# Altium project smart generator controller.PrjPcb (part 1 of 2)
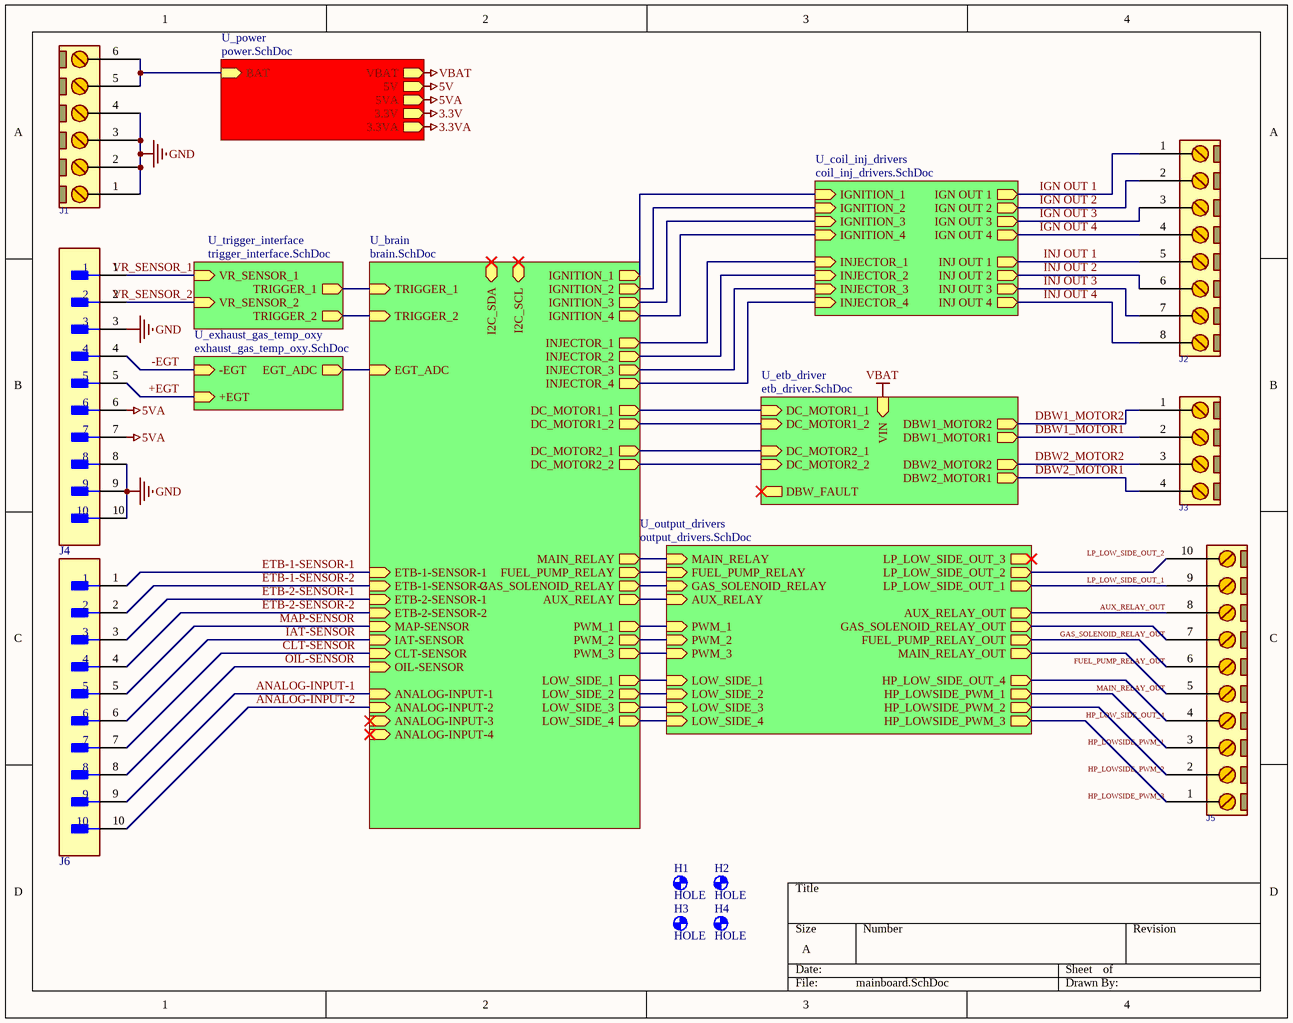
[diagram p0: mainboard.SchDoc]
8 sheets, 297 parts. Net scope: hierarchical (ports join the sheet entries above them; power ports are global).
Board file: PCB1.PcbDoc
Sheets:
  mainboard.SchDoc
    U_etb_driver = etb_driver.SchDoc
    U_power = power.SchDoc
    U_coil_inj_drivers = coil_inj_drivers.SchDoc
    U_brain = brain.SchDoc
    U_trigger_interface = trigger_interface.SchDoc
    U_output_drivers = output_drivers.SchDoc
    U_exhaust_gas_temp_oxy = exhaust_gas_temp_oxy.SchDoc

## Sheet mainboard.SchDoc
size A; SheetNumber: 1; SheetTotal: 8

### Parts
H1  HOLE  [P3.2]  (no BOM)
H2  HOLE  [P3.2]  (no BOM)
H3  HOLE  [P3.2]  (no BOM)
H4  HOLE  [P3.2]  (no BOM)
J1  CONN_TB6  [MSTB_6]  (value not drawn)
J2  CONN_TB8  [MSTB_8]  (value not drawn)
J3  CONN_TB4  [MSTB_4]  (value not drawn)
J4  PHOENIX MINI 10P  [CON_PHOENIX_MINI_10]  (value not drawn)
J5  CONN_TB10  [MSTB_10]  (value not drawn)
J6  PHOENIX MINI 10P  [CON_PHOENIX_MINI_10]  (value not drawn)

### Sub-sheets
U_brain = brain.SchDoc: LOW_SIDE_1 (out), INJECTOR_3 (out), INJECTOR_2 (out), INJECTOR_1 (out), I2C_SCL (bidir), I2C_SDA (bidir), TRIGGER_1 (in), MAIN_RELAY (out), FUEL_PUMP_RELAY (out), AUX_RELAY (out), DC_MOTOR1_2 (out), DC_MOTOR1_1 (out), IGNITION_1 (out), ETB-1-SENSOR-1 (in), ETB-1-SENSOR-2 (in), ETB-2-SENSOR-1 (in), ETB-2-SENSOR-2 (in), INJECTOR_4 (out), IGNITION_2 (out), IGNITION_3 (out), IGNITION_4 (out), DC_MOTOR2_2 (out), DC_MOTOR2_1 (out), LOW_SIDE_2 (out), LOW_SIDE_3 (out), LOW_SIDE_4 (out), TRIGGER_2 (in), MAP-SENSOR (in), IAT-SENSOR (in), CLT-SENSOR (in), OIL-SENSOR (in), ANALOG-INPUT-1 (in), ANALOG-INPUT-3 (in), ANALOG-INPUT-4 (in), ANALOG-INPUT-2 (in), PWM_1 (out), PWM_2 (out), PWM_3 (out), EGT_ADC (in), GAS_SOLENOID_RELAY (out)
U_coil_inj_drivers = coil_inj_drivers.SchDoc: IGN OUT 1 (out), IGN OUT 2 (out), IGN OUT 3 (out), IGN OUT 4 (out), INJ OUT 4 (out), INJ OUT 3 (out), INJ OUT 2 (out), INJ OUT 1 (out), IGNITION_2 (in), IGNITION_3 (in), IGNITION_4 (in), INJECTOR_1 (in), INJECTOR_2 (in), INJECTOR_3 (in), INJECTOR_4 (in), IGNITION_1 (in)
U_etb_driver = etb_driver.SchDoc: VIN (in), DBW1_MOTOR1 (out), DBW1_MOTOR2 (out), DBW2_MOTOR1 (out), DBW2_MOTOR2 (out), DBW_FAULT (out), DC_MOTOR1_1 (in), DC_MOTOR1_2 (in), DC_MOTOR2_1 (in), DC_MOTOR2_2 (in)
U_exhaust_gas_temp_oxy = exhaust_gas_temp_oxy.SchDoc: -EGT (in), +EGT (in), EGT_ADC (out)
U_output_drivers = output_drivers.SchDoc: MAIN_RELAY_OUT (out), FUEL_PUMP_RELAY_OUT (out), GAS_SOLENOID_RELAY_OUT (out), AUX_RELAY (in), PWM_1 (in), PWM_2 (in), PWM_3 (in), LOW_SIDE_1 (in), LOW_SIDE_2 (in), LOW_SIDE_3 (in), LOW_SIDE_4 (in), HP_LOWSIDE_PWM_1 (out), HP_LOWSIDE_PWM_2 (out), HP_LOWSIDE_PWM_3 (out), AUX_RELAY_OUT (out), HP_LOW_SIDE_OUT_4 (out), LP_LOW_SIDE_OUT_1 (out), LP_LOW_SIDE_OUT_2 (out), LP_LOW_SIDE_OUT_3 (out), MAIN_RELAY (in), FUEL_PUMP_RELAY (in), GAS_SOLENOID_RELAY (in)
U_power = power.SchDoc: BAT (in), VBAT (out), 5V (out), 5VA (out), 3.3V (out), 3.3VA (out)
U_trigger_interface = trigger_interface.SchDoc: VR_SENSOR_1 (in), VR_SENSOR_2 (in), TRIGGER_2 (out), TRIGGER_1 (out)

### Nets
5VA: J4.6 J4.7 ; sheet U_power/5VA
GND: J1.1 J1.2 J1.3 J1.4 J4.3 J4.8 J4.9 J4.10
VBAT: sheet U_etb_driver/VIN, sheet U_power/VBAT
+EGT: J4.5 ; sheet U_exhaust_gas_temp_oxy/+EGT
-EGT: J4.4 ; sheet U_exhaust_gas_temp_oxy/-EGT
ANALOG-INPUT-1: J6.9 ; sheet U_brain/ANALOG-INPUT-1
ANALOG-INPUT-2: J6.10 ; sheet U_brain/ANALOG-INPUT-2
AUX_RELAY_OUT: J5.8 ; sheet U_output_drivers/AUX_RELAY_OUT
CLT-SENSOR: J6.7 ; sheet U_brain/CLT-SENSOR
DBW1_MOTOR1: J3.2 ; sheet U_etb_driver/DBW1_MOTOR1
DBW1_MOTOR2: J3.1 ; sheet U_etb_driver/DBW1_MOTOR2
DBW2_MOTOR1: J3.4 ; sheet U_etb_driver/DBW2_MOTOR1
DBW2_MOTOR2: J3.3 ; sheet U_etb_driver/DBW2_MOTOR2
ETB-1-SENSOR-1: J6.1 ; sheet U_brain/ETB-1-SENSOR-1
ETB-1-SENSOR-2: J6.2 ; sheet U_brain/ETB-1-SENSOR-2
ETB-2-SENSOR-1: J6.3 ; sheet U_brain/ETB-2-SENSOR-1
ETB-2-SENSOR-2: J6.4 ; sheet U_brain/ETB-2-SENSOR-2
FUEL_PUMP_RELAY_OUT: J5.6 ; sheet U_output_drivers/FUEL_PUMP_RELAY_OUT
GAS_SOLENOID_RELAY_OUT: J5.7 ; sheet U_output_drivers/GAS_SOLENOID_RELAY_OUT
HP_LOW_SIDE_OUT_4: J5.4 ; sheet U_output_drivers/HP_LOW_SIDE_OUT_4
HP_LOWSIDE_PWM_1: J5.3 ; sheet U_output_drivers/HP_LOWSIDE_PWM_1
HP_LOWSIDE_PWM_2: J5.2 ; sheet U_output_drivers/HP_LOWSIDE_PWM_2
HP_LOWSIDE_PWM_3: J5.1 ; sheet U_output_drivers/HP_LOWSIDE_PWM_3
IAT-SENSOR: J6.6 ; sheet U_brain/IAT-SENSOR
IGN OUT 1: J2.1 ; sheet U_coil_inj_drivers/IGN OUT 1
IGN OUT 2: J2.2 ; sheet U_coil_inj_drivers/IGN OUT 2
IGN OUT 3: J2.3 ; sheet U_coil_inj_drivers/IGN OUT 3
IGN OUT 4: J2.4 ; sheet U_coil_inj_drivers/IGN OUT 4
INJ OUT 1: J2.5 ; sheet U_coil_inj_drivers/INJ OUT 1
INJ OUT 2: J2.6 ; sheet U_coil_inj_drivers/INJ OUT 2
INJ OUT 3: J2.7 ; sheet U_coil_inj_drivers/INJ OUT 3
INJ OUT 4: J2.8 ; sheet U_coil_inj_drivers/INJ OUT 4
LP_LOW_SIDE_OUT_1: J5.9 ; sheet U_output_drivers/LP_LOW_SIDE_OUT_1
LP_LOW_SIDE_OUT_2: J5.10 ; sheet U_output_drivers/LP_LOW_SIDE_OUT_2
MAIN_RELAY_OUT: J5.5 ; sheet U_output_drivers/MAIN_RELAY_OUT
MAP-SENSOR: J6.5 ; sheet U_brain/MAP-SENSOR
OIL-SENSOR: J6.8 ; sheet U_brain/OIL-SENSOR
VR_SENSOR_1: J4.1 ; sheet U_trigger_interface/VR_SENSOR_1
VR_SENSOR_2: J4.2 ; sheet U_trigger_interface/VR_SENSOR_2
NetF2_1: J1.5 J1.6 ; sheet U_power/BAT
NetQ15_1: sheet U_brain/MAIN_RELAY, sheet U_output_drivers/MAIN_RELAY
NetQ15_2: sheet U_brain/FUEL_PUMP_RELAY, sheet U_output_drivers/FUEL_PUMP_RELAY
NetQ15_3: sheet U_brain/GAS_SOLENOID_RELAY, sheet U_output_drivers/GAS_SOLENOID_RELAY
NetQ15_4: sheet U_brain/AUX_RELAY, sheet U_output_drivers/AUX_RELAY
NetQ15_5: sheet U_brain/LOW_SIDE_1, sheet U_output_drivers/LOW_SIDE_1
NetQ15_6: sheet U_brain/LOW_SIDE_2, sheet U_output_drivers/LOW_SIDE_2
NetQ15_7: sheet U_brain/LOW_SIDE_3, sheet U_output_drivers/LOW_SIDE_3
NetR5_2: sheet U_coil_inj_drivers/IGNITION_2, sheet U_brain/IGNITION_2
NetR6_2: sheet U_coil_inj_drivers/IGNITION_1, sheet U_brain/IGNITION_1
NetR7_2: sheet U_coil_inj_drivers/INJECTOR_2, sheet U_brain/INJECTOR_2
NetR8_2: sheet U_coil_inj_drivers/INJECTOR_1, sheet U_brain/INJECTOR_1
NetR13_2: sheet U_coil_inj_drivers/IGNITION_4, sheet U_brain/IGNITION_4
NetR14_2: sheet U_coil_inj_drivers/IGNITION_3, sheet U_brain/IGNITION_3
NetR15_2: sheet U_coil_inj_drivers/INJECTOR_4, sheet U_brain/INJECTOR_4
NetR16_2: sheet U_coil_inj_drivers/INJECTOR_3, sheet U_brain/INJECTOR_3
NetR99_2: sheet U_brain/TRIGGER_1, sheet U_trigger_interface/TRIGGER_1
NetR115_2: sheet U_brain/TRIGGER_2, sheet U_trigger_interface/TRIGGER_2
NetR136_2: sheet U_brain/PWM_2, sheet U_output_drivers/PWM_2
NetR137_2: sheet U_brain/PWM_3, sheet U_output_drivers/PWM_3
NetR141_2: sheet U_brain/LOW_SIDE_4, sheet U_output_drivers/LOW_SIDE_4
NetR142_2: sheet U_brain/PWM_1, sheet U_output_drivers/PWM_1
NetU8_3: sheet U_etb_driver/DC_MOTOR1_1, sheet U_brain/DC_MOTOR1_1
NetU8_19: sheet U_etb_driver/DC_MOTOR1_2, sheet U_brain/DC_MOTOR1_2
NetU9_3: sheet U_etb_driver/DC_MOTOR2_1, sheet U_brain/DC_MOTOR2_1
NetU9_19: sheet U_etb_driver/DC_MOTOR2_2, sheet U_brain/DC_MOTOR2_2
NetU11_8: sheet U_brain/EGT_ADC, sheet U_exhaust_gas_temp_oxy/EGT_ADC

### Library data of the parts
H1-H4 = MOUNT-HOLE: MOUNTING HOLE with drill center marker
J1 = CONN_MSTB_6: CONN, PHOENIX MSTB, 5-G, 5.08mm pitch; PARAM2: 320V; PARAM: 12A; VALUE: CONN_TB6
J2 = CONN_MSTB_8: CONN, PHOENIX MSTB, 5-G, 5.08mm pitch; PARAM2: 320V; PARAM: 12A; VALUE: CONN_TB8
J3 = CONN_MSTB_4: CONN, PHOENIX MSTB, 5-G, 5.08mm pitch; PARAM2: 320V; PARAM: 12A; VALUE: CONN_TB4
J4 J6 = PHOENIX MINI 10P: 1803358 Header; 8 A; 160 V; 3.81; 10; Soldering; 1.2 mm; 2.5 kV; 160/250 V; PBT; NexarPartId: 71670; Number of Positions Per Level: 10; Voltage Rating: 160V; Current: 8A; Number of Levels: 1; Connector Type: Plug; Approvals: CSA, UL; Voltage Rating (DC): 640mV; Gender: Male; Voltage: 300V; Test Voltage: 2.5kV; Pitch: 3.81mm; Housing Material: Polybutylene; Depth: 9.2mm; Max Current Rating: 8A; Voltage Rating (AC): 160V; Contact Material: Tin; Termination: Solder; Lead Pitch: 3.81mm; Current Rating: 8A; Mount: Through Hole; Flammability Rating: UL94 V-0; Number of Rows: 1; Lead Free: Lead Free; RoHS: Compliant; Length: 39.49mm; Weight: 113.398093g; Housing Color: Green; Number of Contacts: 10; Contact Gender: Male; Number of Positions: 10; Height: 7.4mm; Orientation: Right Angle; Color: Green; Contact Plating: Tin; Number of Poles: 10; Width: 39.49mm
J5 = CONN_MSTB_10: CONN, PHOENIX MSTB, 5-G, 5.08mm pitch; PARAM2: 320V; PARAM: 12A; VALUE: CONN_TB10

## Sheet etb_driver.SchDoc
size A4; SheetNumber: 4; SheetTotal: 8
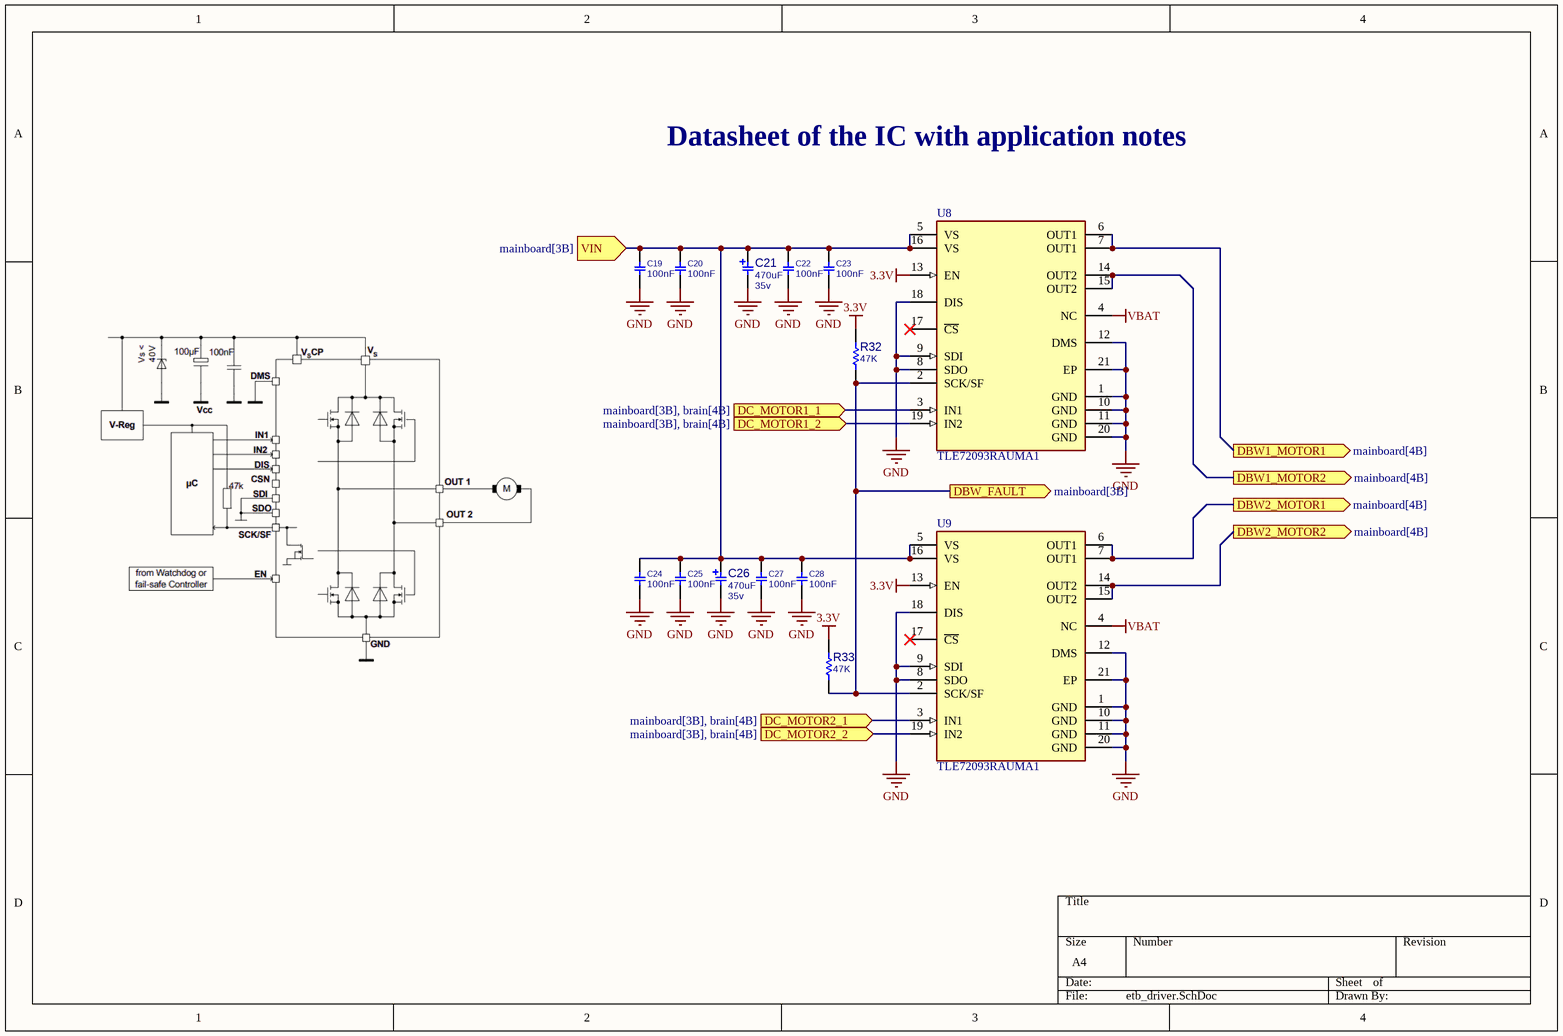
[diagram p1: etb_driver.SchDoc]

### Parts
C19  100nF  [C1206]
C20  100nF  [C1206]
C21  PARAM2: 35v  [C_EL_D10L10]  (hidden comment: 470uF)
C22  100nF  [C1206]
C23  100nF  [C1206]
C24  100nF  [C1206]
C25  100nF  [C1206]
C26  PARAM2: 35v  [C_EL_D10L10]  (hidden comment: 470uF)
C27  100nF  [C1206]
C28  100nF  [C1206]
R32  47K  [R0805]
R33  47K  [R0805]  (no BOM)
U8  TLE72093RAUMA1  [FP-PG-DSO-20-MFG]
U9  TLE72093RAUMA1  [FP-PG-DSO-20-MFG]

### Ports
DBW1_MOTOR1 (out, see mainboard[4B]), DBW1_MOTOR2 (out, see mainboard[4B]), DBW2_MOTOR1 (out, see mainboard[4B]), DBW2_MOTOR2 (out, see mainboard[4B]), DBW_FAULT (out, see mainboard[3B]), DC_MOTOR1_1 (in, see mainboard[3B], brain[4B]), DC_MOTOR1_2 (in, see mainboard[3B], brain[4B]), DC_MOTOR2_1 (in, see mainboard[3B], brain[4B]), DC_MOTOR2_2 (in, see mainboard[3B], brain[4B]), VIN (in, see mainboard[3B])

### Nets
3.3V: R32.2 R33.2 U8.13(EN) U9.13(EN)
GND: C19.1 C20.1 C21.2 C22.1 C23.1 C24.1 C25.1 C26.2 C27.1 C28.1 U8.1(GND) U8.8(SDO) U8.9(SDI) U8.10(GND) U8.11(GND) U8.12(DMS) U8.18(DIS) U8.20(GND) U8.21(EP) U9.1(GND) U9.8(SDO) U9.9(SDI) U9.10(GND) U9.11(GND) U9.12(DMS) U9.18(DIS) U9.20(GND) U9.21(EP)
VBAT: C19.2 C20.2 C21.1 C22.2 C23.2 C24.2 C25.2 C26.1 C27.2 C28.2 U8.4(NC) U8.5(VS) U8.16(VS) U9.4(NC) U9.5(VS) U9.16(VS) ; port VIN
DBW1_MOTOR1: U8.6(OUT1) U8.7(OUT1) ; port DBW1_MOTOR1
DBW1_MOTOR2: U8.14(OUT2) U8.15(OUT2) ; port DBW1_MOTOR2
DBW2_MOTOR1: U9.6(OUT1) U9.7(OUT1) ; port DBW2_MOTOR1
DBW2_MOTOR2: U9.14(OUT2) U9.15(OUT2) ; port DBW2_MOTOR2
NetR32_1: R32.1 R33.1 U8.2(SCK/SF) U9.2(SCK/SF) ; port DBW_FAULT
NetU8_3: U8.3(IN1) ; port DC_MOTOR1_1
NetU8_19: U8.19(IN2) ; port DC_MOTOR1_2
NetU9_3: U9.3(IN1) ; port DC_MOTOR2_1
NetU9_19: U9.19(IN2) ; port DC_MOTOR2_2

Not connected (* = marked no-connect by the designer): U8 17(~{CS})*; U9 17(~{CS})*

### Notes on the sheet
- Datasheet of the IC with application notes <https://www.infineon.com/dgdl/Infineon-TLE7209_2R-DS-v01_05-en.pdf?fileId=db3a30431f848401011fc76ca8e77a06>

### Library data of the parts
C19 C20 C22-C25 C27 C28 = CAP_SMD_MLCC_1206: CAP, MLCC; PARAM: -, -%; MANF_P#: MANF_PART#; PARAM2: -V; PRICE: 100= 1$; MANF: -; ASSEMBLY: ASSEMBLY; VALUE: 100nF
C21 C26 = CAP_SMD_EL_470uF_35v: CAP, SMD, ELEC,; MANF_P#: MANF_PART#; DESC: DESCRIPTION; DIST#: MOUSER; PARAM: 20%; PRICE: 10= -$; MANF: MANF; ASSEMBLY: ASSEMBLY; VALUE: 470uF
R32 R33 = RES_SMD_0805: RESISTOR, SMD; PARAM: -W; DESC: DESCRIPTION; DIST#: MOUSER; PARAM2: 1%; MANF_P#: -; MANF: -; ASSEMBLY: ASSEMBLY; PRICE: 100= 0.5$; VALUE: 47K
U8 U9 = TLE7209: IC MOTOR DRIVER 3.5V-5.5V 20DSO; Logic Function: AND GATE; Max Supply Voltage: 28V; Output Current: 5A; Interface: SPI; RoHS Compliant: Yes; Lead Free: Contains Lead; Series: -; Max Operating Temperature: 150°C; Packaging: Tape and Reel; Mount: Surface Mount; Halogen Free: Halogen Free; Min Operating Temperature: -40°C

## Sheet power.SchDoc
size A; SheetNumber: 3; SheetTotal: 8
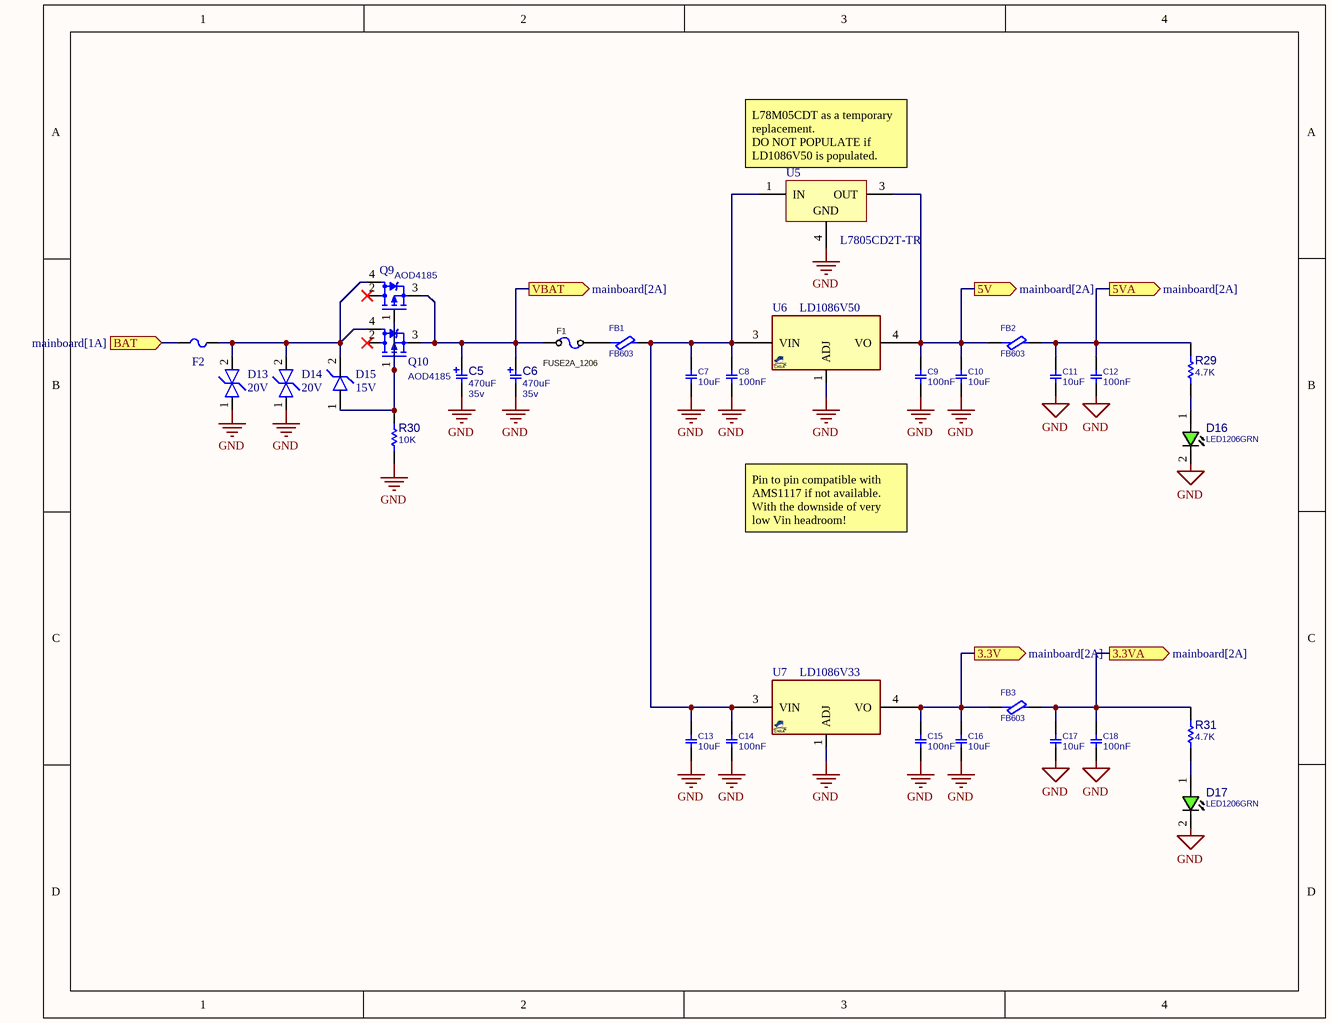
[diagram p2: power.SchDoc]

### Parts
C5  PARAM2: 35v  [C_EL_D10L10]  (hidden comment: 470uF)
C6  PARAM2: 35v  [C_EL_D10L10]  (hidden comment: 470uF)
C7  10uF  [C1206]
C8  100nF  [C1206]
C9  100nF  [C1206]
C10  10uF  [C1206]
C11  10uF  [C1206]
C12  100nF  [C1206]
C13  10uF  [C1206]
C14  100nF  [C1206]
C15  100nF  [C1206]
C16  10uF  [C1206]
C17  10uF  [C1206]
C18  100nF  [C1206]
D13  20V  [FP-SMBJ-CA-MFG]
D14  20V  [FP-SMBJ-CA-MFG]
D15  15V  [D_SOD80]
D16  LED1206GRN  [LED1206GRN]
D17  LED1206GRN  [LED1206GRN]
F1  FUSE2A_1206  [F1206]
F2  F=15 A  [FUSE - Double PAD]  (value not drawn)
FB1  FB603  [L1206]
FB2  FB603  [L1206]
FB3  FB603  [L1206]
Q9  AOD4185  [D2PAK_3]
Q10  AOD4185  [D2PAK_3]
R29  4.7K  [R0805]
R30  10K  [R0805]
R31  4.7K  [R0805]
U5  L7805CD2T-TR  [TO-263_M]
U6  LD1086V50  [DPAK_3]
U7  LD1086V33  [DPAK_3]

### Ports
3.3V (out, see mainboard[2A]), 3.3VA (out, see mainboard[2A]), 5V (out, see mainboard[2A]), 5VA (out, see mainboard[2A]), BAT (in, see mainboard[1A]), VBAT (out, see mainboard[2A])

### Nets
3.3V: C15.2 C16.2 FB3.2 U7.4(VO) ; port 3.3V
3.3VA: C17.2 C18.2 FB3.1 R31.2 ; port 3.3VA
5V: C9.2 C10.2 FB2.2 U5.3(OUT) U6.4(VO) ; port 5V
5VA: C11.2 C12.2 FB2.1 R29.2 ; port 5VA
GND: C5.2 C6.2 C7.1 C8.1 C9.1 C10.1 C11.1 C12.1 C13.1 C14.1 C15.1 C16.1 C17.1 C18.1 D13.1 D14.1 D16.2(CATHODE) D17.2(CATHODE) R30.1 U5.4(GND) U6.1(ADJ) U7.1(ADJ)
VBAT: C5.1 C6.1 F1.1 Q9.3(S) Q10.3(S) ; port VBAT
NetC7_2: C7.2 C8.2 C13.2 C14.2 FB1.1 U5.1(IN) U6.3(VIN) U7.3(VIN)
NetD13_2: D13.2 D14.2 D15.2 F2.2 Q9.4(D) Q10.4(D)
NetD15_1: D15.1 Q9.1(G) Q10.1(G) R30.2
NetD16_1: D16.1(ANODE) R29.1
NetD17_1: D17.1(ANODE) R31.1
NetF1_2: F1.2 FB1.2
NetF2_1: F2.1 ; port BAT

Not connected (* = marked no-connect by the designer): Q9 2(D)*; Q10 2(D)*

### Notes on the sheet
- (near U5) L78M05CDT as a temporary replacement.
  DO NOT POPULATE if LD1086V50 is populated.
- Pin to pin compatible with AMS1117 if not available.
  With the downside of very low Vin headroom!

### Library data of the parts
C5 C6 = CAP_SMD_EL_470uF_35v: as C21 on sheet etb_driver; PRICE: 10= -$; MANF: MANF; ASSEMBLY: ASSEMBLY; VALUE: 470uF
C7 C10 C11 C13 C16 C17 = CAP_SMD_MLCC: CAP, MLCC; PARAM: C0G, 10%; DESC: CAP, MLCC, 1nF, 50V, C0G, 10%, 0402; MANF_P#: MANF_PART#; MANF: Murata; PARAM2: 50V; PRICE: 100= 1$; ASSEMBLY: ASSEMBLY; VALUE: 10uF
C8 C9 C12 C14 C15 C18 = CAP_SMD_MLCC_1206: as C19 on sheet etb_driver; PRICE: 100= 1$; MANF: -; ASSEMBLY: ASSEMBLY; VALUE: 100nF
D13 D14 = TVS: TVS DIODE; Direction: Bidirectional; Reverse Standoff Voltage: 20V; ComponentLink2Description: Datasheet; ComponentLink2URL: https://www.bourns.com/docs/Product-Datasheets/SMBJ.pdf
D15 = Zener-SOD-80
D16 D17 = LED_SMD_1206_GRN: LED, SMD, 1206, GREEN; PARAM: 20mA; DESC: DESCRIPTION; PARAM2: 2.2V; MANF: -; ASSEMBLY: ASSEMBLY; PRICE: 36t@Javan; MANF_P#: -; VALUE: LED1206GRN
F1 = FUSE_3A_1206_SLOW: Fuse, 3A, 32VDC, 1206, SMD, Slow Blow; PARAM: 3A; 32VDC; Slow Blow; MANF: Bourns; MANF_P#: SF-1206SP300-2; PARAM2: 0.027Ohm; PRICE: 0.9$; VALUE: FUSE2A_1206
F2 = Fuse 5x20 with holdeer pins: Fuses 5x20; Designer: Abbas Basereh; Desc.: fuse with holder pins 5x20; Data: 28-12-2016
FB1-FB3 = FBEAD_SMD: FERRITE_Bead, SMD; MANF: MURATA; PARAM: 120@100MHz; PARAM2: 1A; MANF_P#: BLM15AG121SN1D; VALUE: FB603
Q9 Q10 = MOSP_IRF4905_D2PAK: HEXFET Power MOSFET; ASSEMBLY: ASSEMBLY; MANF_P#: IRF4905; VALUE: AOD4185
R29-R31 = RES_SMD_0805: as R32 on sheet etb_driver; MANF_P#: -; MANF: -; ASSEMBLY: ASSEMBLY; PRICE: 100= 0.5$
  R29 R31: VALUE: 4.7K
  R30: VALUE: 10K
U5 = CMP-0244-00213-1: Positive Voltage Regulator, 3-Pin D2PAK, Tape and Reel; PackageReference: TO-263; ComponentLink2URL: http://www.st.com/internet/com/TECHNICAL_RESOURCES/TECHNICAL_LITERATURE/DATASHEET/CD00000444.pdf; PackageDescription: 3-Pin Transistor Outline Package 2.54 mm Pitch, 15.4 mm Lead Span (D2PAK); DatasheetVersion: 16/11/2011; ComponentLink2Description: Datasheet; ComponentLink1Description: Manufacturer URL; PackageVersion: 2011; ComponentLink1URL: http://www.st.com
U6 U7 = VREG_1086_TO252: REG, Linear, LDO1.3, Adj, 1A, TO-252; MANF_P#: LD1086DTTR, LD1086D2MTR; MANF: ST; PARAM2: 2.8~30VIN, 1.3VDROP, 1.25VREF; PARAM: 1A
  U6: VALUE: LD1086V50
  U7: VALUE: LD1086V33

## Sheet coil_inj_drivers.SchDoc
size A4; SheetNumber: 2; SheetTotal: 8
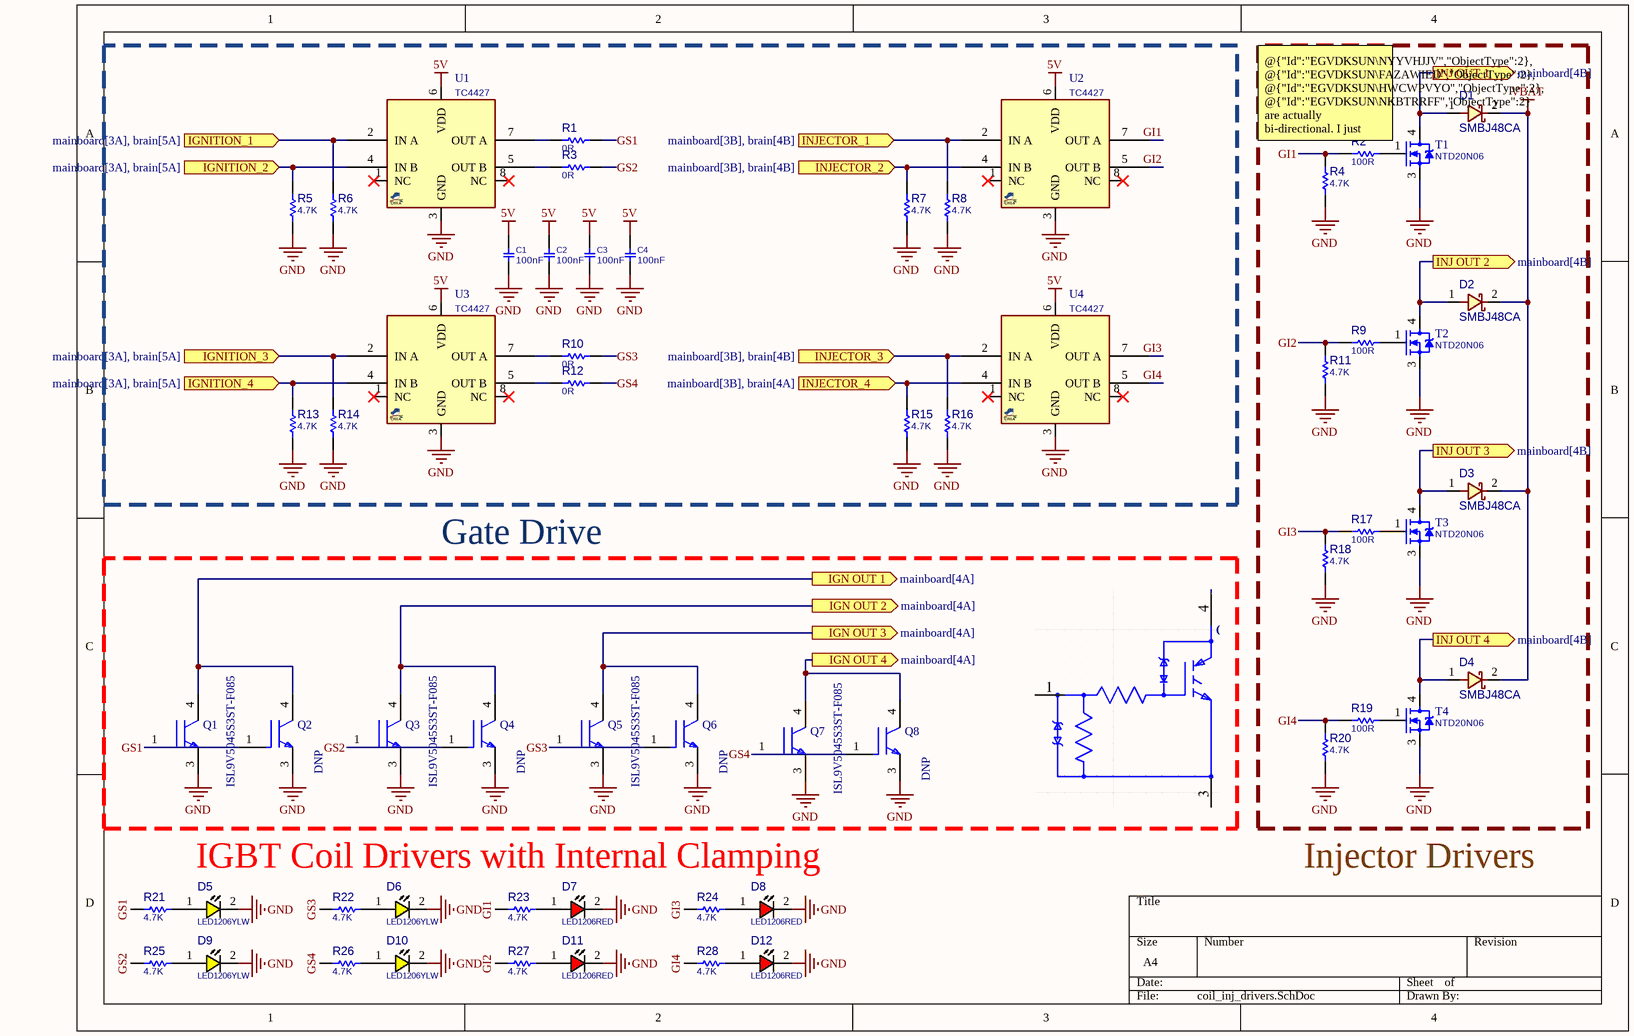
[diagram p3: coil_inj_drivers.SchDoc]

### Parts
C1  100nF  [C1206]
C2  100nF  [C1206]
C3  100nF  [C1206]
C4  100nF  [C1206]
D1  SMBJ48CA  [D_SMB]
D2  SMBJ48CA  [D_SMB]
D3  SMBJ48CA  [D_SMB]
D4  SMBJ48CA  [D_SMB]
D5  LED1206YLW  [LED1206YLW]
D6  LED1206YLW  [LED1206YLW]
D7  LED1206RED  [LED1206RED]
D8  LED1206RED  [LED1206RED]
D9  LED1206YLW  [LED1206YLW]
D10  LED1206YLW  [LED1206YLW]
D11  LED1206RED  [LED1206RED]
D12  LED1206RED  [LED1206RED]
Q1  ISL9V5045S3ST-F085  [FP-418AJ-MFG]
Q2  DNP  [FP-369AS-MFG]
Q3  ISL9V5045S3ST-F085  [FP-418AJ-MFG]
Q4  DNP  [FP-369AS-MFG]
Q5  ISL9V5045S3ST-F085  [FP-418AJ-MFG]
Q6  DNP  [FP-369AS-MFG]
Q7  ISL9V5045S3ST-F085  [FP-418AJ-MFG]
Q8  DNP  [FP-369AS-MFG]
R1  0R  [R0805]
R2  100R  [R0805]
R3  0R  [R0805]
R4  4.7K  [R0805]
R5  4.7K  [R0805]
R6  4.7K  [R0805]
R7  4.7K  [R0805]
R8  4.7K  [R0805]
R9  100R  [R0805]
R10  0R  [R0805]
R11  4.7K  [R0805]
R12  0R  [R0805]
R13  4.7K  [R0805]
R14  4.7K  [R0805]
R15  4.7K  [R0805]
R16  4.7K  [R0805]
R17  100R  [R0805]
R18  4.7K  [R0805]
R19  100R  [R0805]
R20  4.7K  [R0805]
R21  4.7K  [R0805]
R22  4.7K  [R0805]
R23  4.7K  [R0805]
R24  4.7K  [R0805]
R25  4.7K  [R0805]
R26  4.7K  [R0805]
R27  4.7K  [R0805]
R28  4.7K  [R0805]
T1  NTD20N06  [DPAK_3]
T2  NTD20N06  [DPAK_3]
T3  NTD20N06  [DPAK_3]
T4  NTD20N06  [DPAK_3]
U1  TC4427  [SO_8]
U2  TC4427  [SO_8]
U3  TC4427  [SO_8]
U4  TC4427  [SO_8]

### Ports
IGN OUT 1 (out, see mainboard[4A]), IGN OUT 2 (out, see mainboard[4A]), IGN OUT 3 (out, see mainboard[4A]), IGN OUT 4 (out, see mainboard[4A]), IGNITION_1 (in, see mainboard[3A], brain[5A]), IGNITION_2 (in, see mainboard[3A], brain[5A]), IGNITION_3 (in, see mainboard[3A], brain[5A]), IGNITION_4 (in, see mainboard[3A], brain[5A]), INJ OUT 1 (out, see mainboard[4B]), INJ OUT 2 (out, see mainboard[4B]), INJ OUT 3 (out, see mainboard[4B]), INJ OUT 4 (out, see mainboard[4B]), INJECTOR_1 (in, see mainboard[3B], brain[4B]), INJECTOR_2 (in, see mainboard[3B], brain[4B]), INJECTOR_3 (in, see mainboard[3B], brain[4B]), INJECTOR_4 (in, see mainboard[3B], brain[4A])

### Nets
5V: C1.2 C2.2 C3.2 C4.2 U1.6(VDD) U2.6(VDD) U3.6(VDD) U4.6(VDD)
GND: C1.1 C2.1 C3.1 C4.1 D5.2(CATHODE) D6.2(CATHODE) D7.2(CATHODE) D8.2(CATHODE) D9.2(CATHODE) D10.2(CATHODE) D11.2(CATHODE) D12.2(CATHODE) Q1.3(E) Q2.3(E) Q3.3(E) Q4.3(E) Q5.3(E) Q6.3(E) Q7.3(E) Q8.3(E) R4.1 R5.1 R6.1 R7.1 R8.1 R11.1 R13.1 R14.1 R15.1 R16.1 R18.1 R20.1 T1.3(S) T2.3(S) T3.3(S) T4.3(S) U1.3(GND) U2.3(GND) U3.3(GND) U4.3(GND)
VBAT: D1.2 D2.2 D3.2 D4.2
GI1: R2.2 R4.2 R23.2 U2.7(OUT_A)
GI2: R9.2 R11.2 R27.2 U2.5(OUT_B)
GI3: R17.2 R18.2 R24.2 U4.7(OUT_A)
GI4: R19.2 R20.2 R28.2 U4.5(OUT_B)
GS1: Q1.1(GATE) Q2.1(GATE) R1.1 R21.2
GS2: Q3.1(GATE) Q4.1(GATE) R3.1 R25.2
GS3: Q5.1(GATE) Q6.1(GATE) R10.1 R22.2
GS4: Q7.1(GATE) Q8.1(GATE) R12.1 R26.2
IGN OUT 1: Q1.4(C) Q2.4(C) ; port IGN OUT 1
IGN OUT 2: Q3.4(C) Q4.4(C) ; port IGN OUT 2
IGN OUT 3: Q5.4(C) Q6.4(C) ; port IGN OUT 3
IGN OUT 4: Q7.4(C) Q8.4(C) ; port IGN OUT 4
INJ OUT 1: D1.1 T1.4(D) ; port INJ OUT 1
INJ OUT 2: D2.1 T2.4(D) ; port INJ OUT 2
INJ OUT 3: D3.1 T3.4(D) ; port INJ OUT 3
INJ OUT 4: D4.1 T4.4(D) ; port INJ OUT 4
NetD5_1: D5.1(ANODE) R21.1
NetD6_1: D6.1(ANODE) R22.1
NetD7_1: D7.1(ANODE) R23.1
NetD8_1: D8.1(ANODE) R24.1
NetD9_1: D9.1(ANODE) R25.1
NetD10_1: D10.1(ANODE) R26.1
NetD11_1: D11.1(ANODE) R27.1
NetD12_1: D12.1(ANODE) R28.1
NetR1_2: R1.2 U1.7(OUT_A)
NetR2_1: R2.1 T1.1(G)
NetR3_2: R3.2 U1.5(OUT_B)
NetR5_2: R5.2 U1.4(IN_B) ; port IGNITION_2
NetR6_2: R6.2 U1.2(IN_A) ; port IGNITION_1
NetR7_2: R7.2 U2.4(IN_B) ; port INJECTOR_2
NetR8_2: R8.2 U2.2(IN_A) ; port INJECTOR_1
NetR9_1: R9.1 T2.1(G)
NetR10_2: R10.2 U3.7(OUT_A)
NetR12_2: R12.2 U3.5(OUT_B)
NetR13_2: R13.2 U3.4(IN_B) ; port IGNITION_4
NetR14_2: R14.2 U3.2(IN_A) ; port IGNITION_3
NetR15_2: R15.2 U4.4(IN_B) ; port INJECTOR_4
NetR16_2: R16.2 U4.2(IN_A) ; port INJECTOR_3
NetR17_1: R17.1 T3.1(G)
NetR19_1: R19.1 T4.1(G)

Not connected (* = marked no-connect by the designer): U1 1(NC)* 8(NC)*; U2 1(NC)* 8(NC)*; U3 1(NC)* 8(NC)*; U4 1(NC)* 8(NC)*

### Notes on the sheet
- @{"Id":"EGVDKSUN\NYYVHJJV","ObjectType":2}, @{"Id":"EGVDKSUN\FAZAWIED","ObjectType":2}, @{"Id":"EGVDKSUN\HWCWPVYO","ObjectType":2}, @{"Id":"EGVDKSUN\NKBTRRFF","ObjectType":2} are actually bi-directional. I just didn't have the symbol :(   The footprint is correct though :)
- Gate Drive
- IGBT Coil Drivers with Internal Clamping
- Injector Drivers

### Library data of the parts
C1-C4 = CAP_SMD_MLCC: as C7 on sheet power; PRICE: 100= 1$; ASSEMBLY: ASSEMBLY; VALUE: 100nF
D1-D4 = DIODE_SMD_SCHOTTKY_SS34: DIODE, SCHOTTKY, 20V, 3A; MANF: VISHAY; MANF_P#: SS34; DESC: DESCRIPTION; ASSEMBLY: ASSEMBLY; PRICE: PRICE; PARAM2: 3A; PARAM: 20V; VALUE: SMBJ48CA
D5 D6 D9 D10 = LED_SMD_1206_YLW: LED, SMD, 1206, YELLOW; DESC: DESCRIPTION; MANF_P#: MANF_PART#; PARAM2: 2.2V; MANF: MANF; ASSEMBLY: ASSEMBLY; PRICE: 36t@Javan; VALUE: LED1206YLW
D7 D8 D11 D12 = LED_SMD_1206_RED: LED, SMD, 1206, RED; DESC: DESCRIPTION; MANF_P#: MANF_PART#; PARAM2: 2.2V; MANF: MANF; ASSEMBLY: ASSEMBLY; PRICE: 36t@Javan; VALUE: LED1206RED
Q1 Q3 Q5 Q7 = CMP-00278-87655068-1: ISL9V5045S3ST-F085 Trans IGBT Chip N-CH 445V 51A 300000mW Automotive 3-Pin(2+Tab) D2PAK T/R; Element Configuration: Single; Clamping Voltage: 450V; Collector Emitter Breakdown Voltage: 480V; Collector Emitter Saturation Voltage: 1.25V; Turn-Off Delay Time: 10.8µs; Turn-On Delay Time: 700ns; Power Dissipation: 300W; Max Junction Temperature (Tj): 175°C; Collector Emitter Voltage (VCEO): 1.6V; RoHS: Compliant; Max Collector Current: 51A; Schedule B: 8541290080, 8541290080; Mount: Surface Mount; Max Operating Temperature: 175°C; Min Operating Temperature: -40°C; Number of Pins: 3; NexarPartId: 87655068; Max Breakdown Voltage: 480V; Lead Free: Lead Free; Max Power Dissipation: 300W; Continuous Collector Current: 51A; Height: 5.08mm; Case/Package: TO-263-3; Weight: 1.31247g
Q2 Q4 Q6 Q8 = IGNITION IGBT: NexarPartId: 87655026; Collector Emitter Saturation Voltage: 1.15V; Collector Emitter Voltage (VCEO): 1.5V; Max Collector Current: 41A; Element Configuration: Single; Max Breakdown Voltage: 400V; Max Power Dissipation: 150W; Radiation Hardening: No; RoHS: Compliant; Schedule B: 8541290080, 8541290080|8541290080, 8541290080|8541290080|8541290080, 8541290080|8541290080|8541290080|8541290080; Number of Pins: 3; Max Operating Temperature: 175°C; Mount: Surface Mount; Case/Package: DPAK; Min Operating Temperature: -55°C; Clamping Voltage: 400V; Weight: 260.37mg; Collector Emitter Breakdown Voltage: 400V
R1-R28 = RES_SMD_0805: as R32 on sheet etb_driver; MANF_P#: -; MANF: -; ASSEMBLY: ASSEMBLY; PRICE: 100= 0.5$
  R1 R3 R10 R12: VALUE: 0R
  R2 R9 R17 R19: VALUE: 100R
  R4-R8 R11 R13-R16 R18 R20-R28: VALUE: 4.7K
T1-T4 = MOSN_NTD20N06_DPAK: MOSFET, N-CH, 60V, 20A, 39mRDS, 1~2VGSth; MANF_P#: NTD20N06L; PARAM2: 60VDS, 1~2VGSth; PARAM: 20A, 39mRDS, Cin700pF, -55~150oC; MANF: ON; ASSEMBLY: ASSEMBLY; PRICE: 0.9$; VALUE: NTD20N06
U1-U4 = MOS_DUAL_TC4427: power Mosfet Driver, Dual, High-Speed, 1.5A; ASSEMBLY: ASSEMBLY; MANF_P#: TC4427; VALUE: TC4427

## Sheet brain.SchDoc
size A3; SheetNumber: 5; SheetTotal: 8
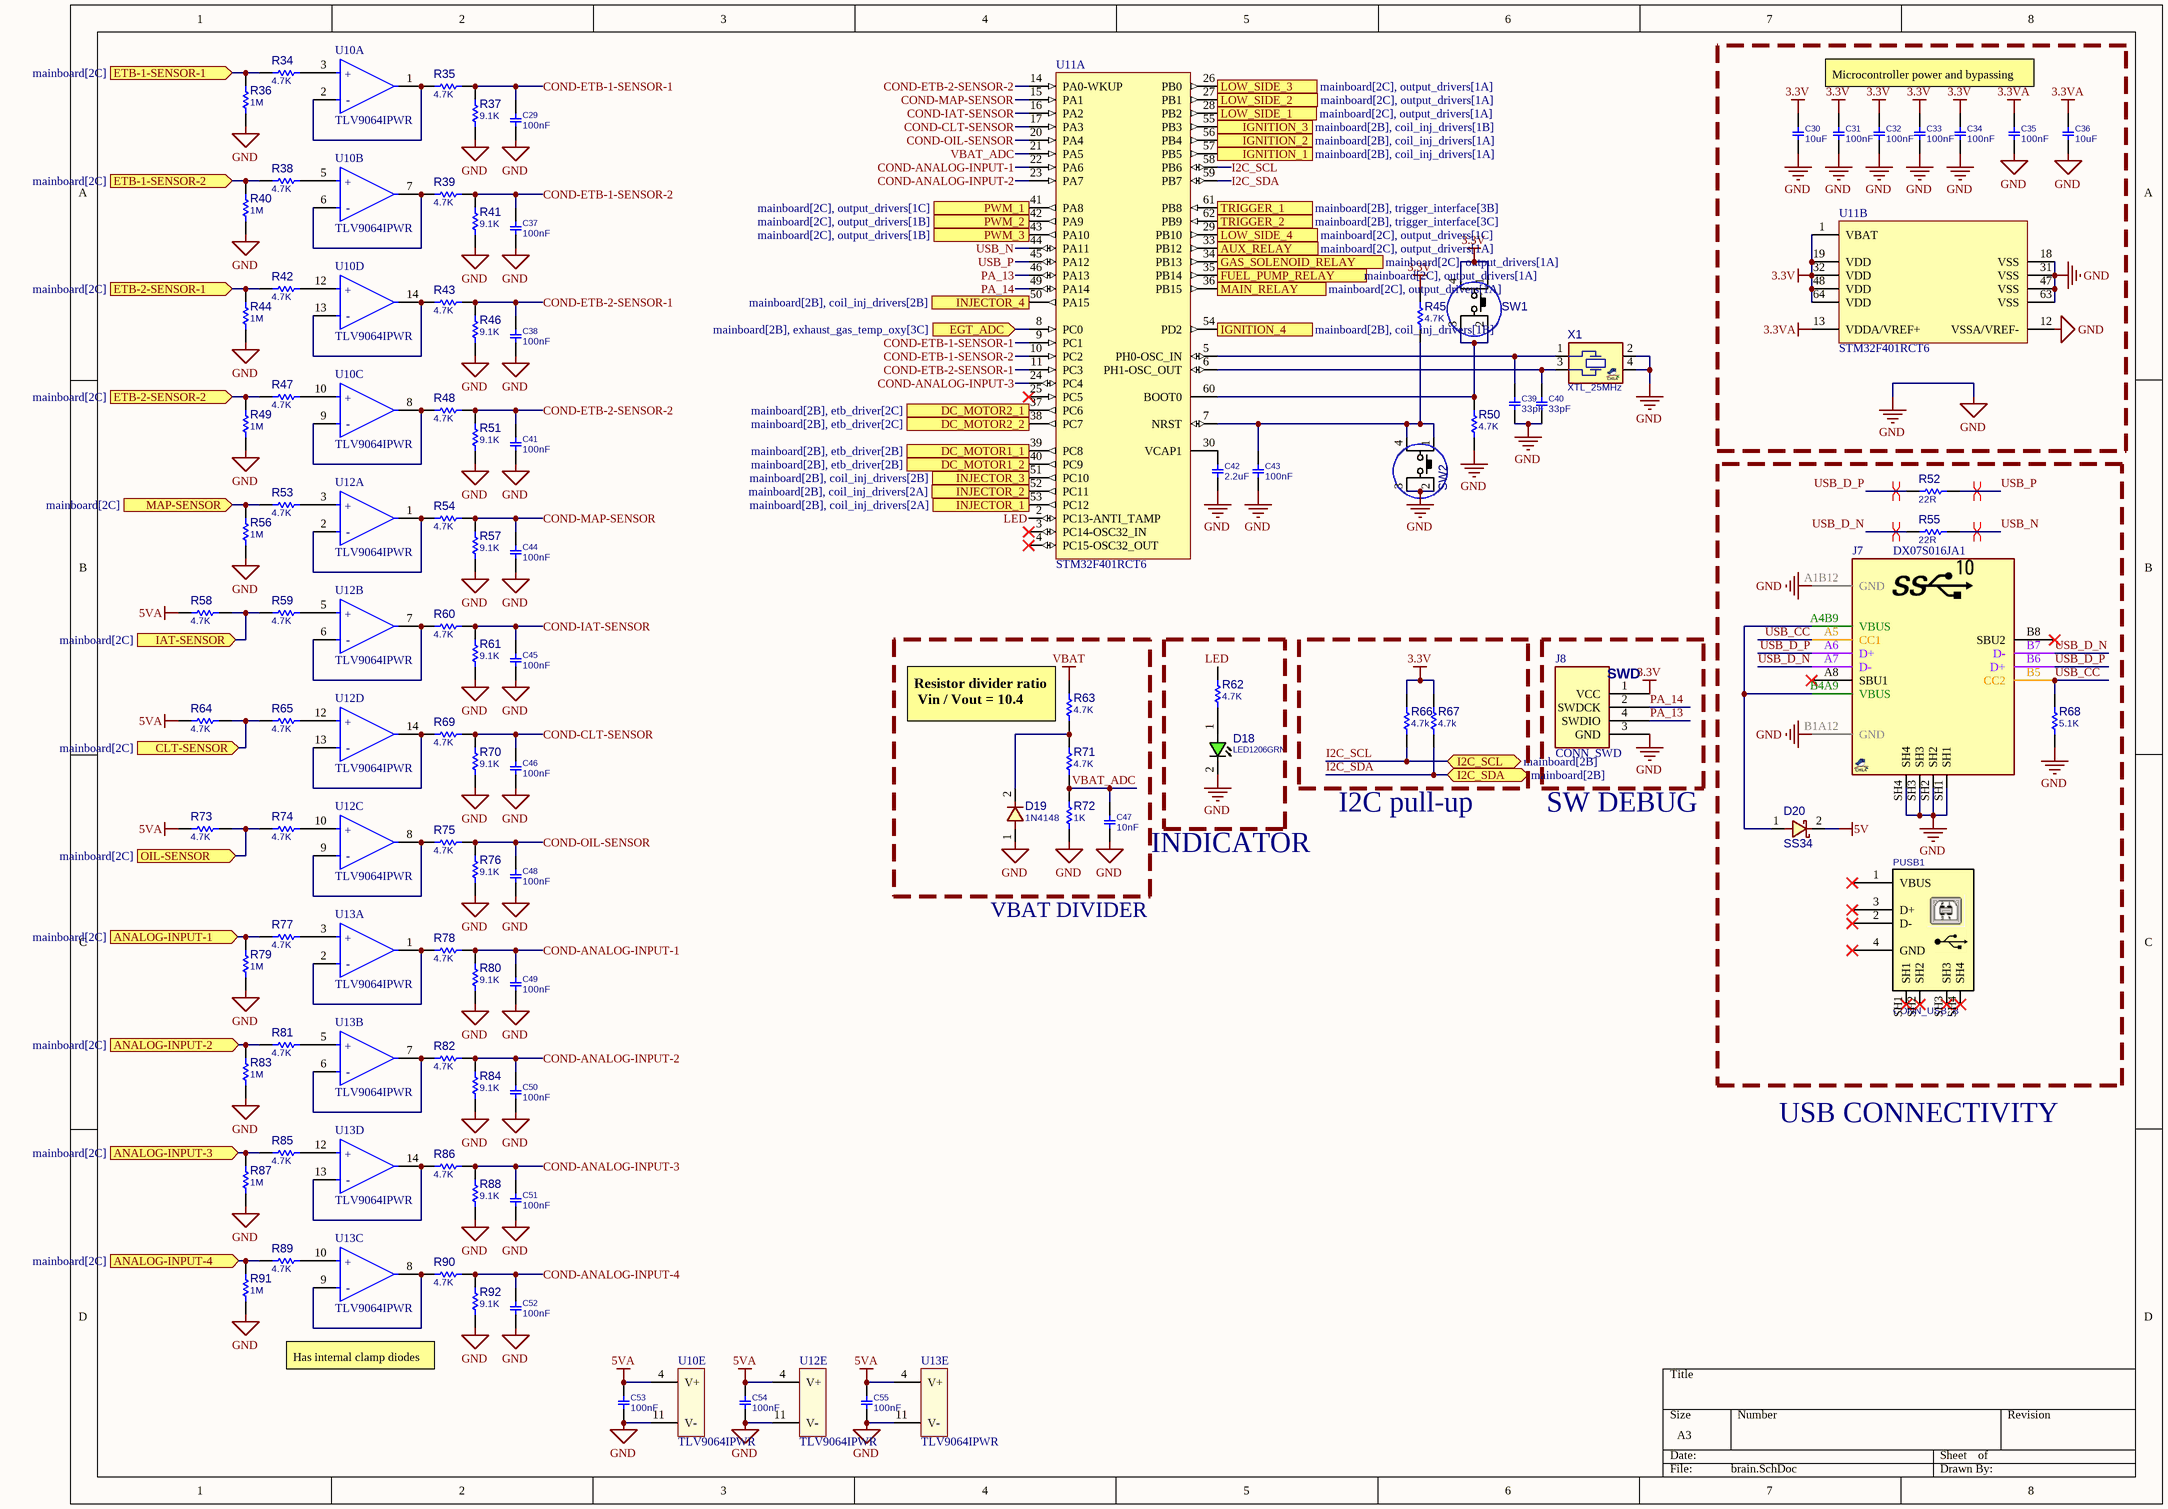
[diagram p4: brain.SchDoc]

### Parts
C29  100nF  [C0805]
C30  10uF  [C0805]
C31  100nF  [C0805]
C32  100nF  [C0805]
C33  100nF  [C0805]
C34  100nF  [C0805]
C35  100nF  [C0805]
C36  10uF  [C0805]
C37  100nF  [C0805]
C38  100nF  [C0805]
C39  33pF  [C0805]
C40  33pF  [C0805]
C41  100nF  [C0805]
C42  2.2uF  [C0805]
C43  100nF  [C0805]
C44  100nF  [C0805]
C45  100nF  [C0805]
C46  100nF  [C0805]
C47  10nF  [C0805]
C48  100nF  [C0805]
C49  100nF  [C0805]
C50  100nF  [C0805]
C51  100nF  [C0805]
C52  100nF  [C0805]
C53  100nF  [C0805]
C54  100nF  [C0805]
C55  100nF  [C0805]
D18  LED1206GRN  [LED1206GRN]
D19  1N4148  [D_SOD80]
D20  SS34  [D_SMB]
J7  DX07S016JA1  [USBC_SMD_16_DX07S016JA1]
J8  CONN_SWD  [WF_4]
PUSB1  CONN_USB_B  [USB_B_ST]
R34  4.7K  [R0805]
R35  4.7K  [R0805]
R36  1M  [R0805]
R37  9.1K  [R0805]
R38  4.7K  [R0805]
R39  4.7K  [R0805]
R40  1M  [R0805]
R41  9.1K  [R0805]
R42  4.7K  [R0805]
R43  4.7K  [R0805]
R44  1M  [R0805]
R45  4.7K  [R0805]
R46  9.1K  [R0805]
R47  4.7K  [R0805]
R48  4.7K  [R0805]
R49  1M  [R0805]
R50  4.7K  [R0805]
R51  9.1K  [R0805]
R52  22R  [R0805]
R53  4.7K  [R0805]
R54  4.7K  [R0805]
R55  22R  [R0805]
R56  1M  [R0805]
R57  9.1K  [R0805]
R58  4.7K  [R0805]
R59  4.7K  [R0805]
R60  4.7K  [R0805]
R61  9.1K  [R0805]
R62  4.7K  [R0805]
R63  4.7K  [R0805]
R64  4.7K  [R0805]
R65  4.7K  [R0805]
R66  4.7k  [R0805]
R67  4.7k  [R0805]
R68  5.1K  [R0805]
R69  4.7K  [R0805]
R70  9.1K  [R0805]
R71  4.7K  [R0805]
R72  1K  [R0805]
R73  4.7K  [R0805]
R74  4.7K  [R0805]
R75  4.7K  [R0805]
R76  9.1K  [R0805]
R77  4.7K  [R0805]
R78  4.7K  [R0805]
R79  1M  [R0805]
R80  9.1K  [R0805]
R81  4.7K  [R0805]
R82  4.7K  [R0805]
R83  1M  [R0805]
R84  9.1K  [R0805]
R85  4.7K  [R0805]
R86  4.7K  [R0805]
R87  1M  [R0805]
R88  9.1K  [R0805]
R89  4.7K  [R0805]
R90  4.7K  [R0805]
R91  1M  [R0805]
R92  9.1K  [R0805]
SW1  PUSHBUTTON  [SWPBS_SPDT_5X5X1]  (value not drawn)
SW2  PUSHBUTTON  [SWPBS_SPDT_5X5X1]  (value not drawn)
U10  TLV9064IPWR  [TTSOP-14]  (parts A,B,C,D,E of 5)
U11  STM32F401RCT6  [STM-LQFP64_L]  (parts A,B of 2)
U12  TLV9064IPWR  [TTSOP-14]  (parts A,B,C,D,E of 5)
U13  TLV9064IPWR  [TTSOP-14]  (parts A,B,C,D,E of 5)
X1  XTL_25MHz  [XTL_4_3225]

### Blocks framed on the sheet
VBAT DIVIDER: C47 D19 R63 R71 R72

### Ports
ANALOG-INPUT-1 (in, see mainboard[2C]), ANALOG-INPUT-2 (in, see mainboard[2C]), ANALOG-INPUT-3 (in, see mainboard[2C]), ANALOG-INPUT-4 (in, see mainboard[2C]), AUX_RELAY (out, see mainboard[2C], output_drivers[1A]), CLT-SENSOR (in, see mainboard[2C]), DC_MOTOR1_1 (out, see mainboard[2B], etb_driver[2B]), DC_MOTOR1_2 (out, see mainboard[2B], etb_driver[2B]), DC_MOTOR2_1 (out, see mainboard[2B], etb_driver[2C]), DC_MOTOR2_2 (out, see mainboard[2B], etb_driver[2C]), EGT_ADC (in, see mainboard[2B], exhaust_gas_temp_oxy[3C]), ETB-1-SENSOR-1 (in, see mainboard[2C]), ETB-1-SENSOR-2 (in, see mainboard[2C]), ETB-2-SENSOR-1 (in, see mainboard[2C]), ETB-2-SENSOR-2 (in, see mainboard[2C]), FUEL_PUMP_RELAY (out, see mainboard[2C], output_drivers[1A]), GAS_SOLENOID_RELAY (out, see mainboard[2C], output_drivers[1A]), I2C_SCL (bidir, see mainboard[2B]), I2C_SDA (bidir, see mainboard[2B]), IAT-SENSOR (in, see mainboard[2C]), IGNITION_1 (out, see mainboard[2B], coil_inj_drivers[1A]), IGNITION_2 (out, see mainboard[2B], coil_inj_drivers[1A]), IGNITION_3 (out, see mainboard[2B], coil_inj_drivers[1B]), IGNITION_4 (out, see mainboard[2B], coil_inj_drivers[1B]), INJECTOR_1 (out, see mainboard[2B], coil_inj_drivers[2A]), INJECTOR_2 (out, see mainboard[2B], coil_inj_drivers[2A]), INJECTOR_3 (out, see mainboard[2B], coil_inj_drivers[2B]), INJECTOR_4 (out, see mainboard[2B], coil_inj_drivers[2B]), LOW_SIDE_1 (out, see mainboard[2C], output_drivers[1A]), LOW_SIDE_2 (out, see mainboard[2C], output_drivers[1A]), LOW_SIDE_3 (out, see mainboard[2C], output_drivers[1A]), LOW_SIDE_4 (out, see mainboard[2C], output_drivers[1C]), MAIN_RELAY (out, see mainboard[2C], output_drivers[1A]), MAP-SENSOR (in, see mainboard[2C]), OIL-SENSOR (in, see mainboard[2C]), PWM_1 (out, see mainboard[2C], output_drivers[1C]), PWM_2 (out, see mainboard[2C], output_drivers[1B]), PWM_3 (out, see mainboard[2C], output_drivers[1B]), TRIGGER_1 (in, see mainboard[2B], trigger_interface[3B]), TRIGGER_2 (in, see mainboard[2B], trigger_interface[3C])

### Nets
3.3V: C30.2 C31.2 C32.2 C33.2 C34.2 J8.1(VCC) R45.2 R66.2 R67.2 SW1.1(P1) SW1.4(P2) U11.1(VBAT) U11.19(VDD) U11.32(VDD) U11.48(VDD) U11.64(VDD)
3.3VA: C35.2 C36.2 U11.13(VDDA/VREF+)
5V: D20.2
5VA: C53.2 C54.2 C55.2 R58.2 R64.2 R73.2 U10.4(V+) U12.4(V+) U13.4(V+)
GND: C29.1 C30.1 C31.1 C32.1 C33.1 C34.1 C35.1 C36.1 C37.1 C38.1 C39.1 C40.1 C41.1 C42.1 C43.1 C44.1 C45.1 C46.1 C47.1 C48.1 C49.1 C50.1 C51.1 C52.1 C53.1 C54.1 C55.1 D18.2(CATHODE) D19.1 J7.A1B12(GND) J7.B1A12(GND) J7.SH1 J7.SH2 J7.SH3 J7.SH4 J8.3(GND) R36.2 R37.2 R40.2 R41.2 R44.2 R46.2 R49.2 R50.1 R51.2 R56.2 R57.2 R61.2 R68.1 R70.2 R72.1 R76.2 R79.2 R80.2 R83.2 R84.2 R87.2 R88.2 R91.2 R92.2 SW2.2(P3) SW2.3(P4) U10.11(V-) U11.12(VSSA/VREF-) U11.18(VSS) U11.31(VSS) U11.47(VSS) U11.63(VSS) U12.11(V-) U13.11(V-) X1.2 X1.4
VBAT: R63.2
ANALOG-INPUT-1: R77.2 R79.1 ; port ANALOG-INPUT-1
ANALOG-INPUT-2: R81.2 R83.1 ; port ANALOG-INPUT-2
CLT-SENSOR: R64.1 R65.2 ; port CLT-SENSOR
COND-ANALOG-INPUT-1: C49.2 R78.1 R80.1 U11.22(PA6)
COND-ANALOG-INPUT-2: C50.2 R82.1 R84.1 U11.23(PA7)
COND-ANALOG-INPUT-3: C51.2 R86.1 R88.1 U11.24(PC4)
COND-ANALOG-INPUT-4: C52.2 R90.1 R92.1
COND-CLT-SENSOR: C46.2 R69.1 R70.1 U11.17(PA3)
COND-ETB-1-SENSOR-1: C29.2 R35.1 R37.1 U11.9(PC1)
COND-ETB-1-SENSOR-2: C37.2 R39.1 R41.1 U11.10(PC2)
COND-ETB-2-SENSOR-1: C38.2 R43.1 R46.1 U11.11(PC3)
COND-ETB-2-SENSOR-2: C41.2 R48.1 R51.1 U11.14(PA0-WKUP)
COND-IAT-SENSOR: C45.2 R60.1 R61.1 U11.16(PA2)
COND-MAP-SENSOR: C44.2 R54.1 R57.1 U11.15(PA1)
COND-OIL-SENSOR: C48.2 R75.1 R76.1 U11.20(PA4)
ETB-1-SENSOR-1: R34.2 R36.1 ; port ETB-1-SENSOR-1
ETB-1-SENSOR-2: R38.2 R40.1 ; port ETB-1-SENSOR-2
ETB-2-SENSOR-1: R42.2 R44.1 ; port ETB-2-SENSOR-1
ETB-2-SENSOR-2: R47.2 R49.1 ; port ETB-2-SENSOR-2
I2C_SCL: R66.1 U11.58(PB6) ; port I2C_SCL
I2C_SDA: R67.1 U11.59(PB7) ; port I2C_SDA
IAT-SENSOR: R58.1 R59.2 ; port IAT-SENSOR
LED: R62.2 U11.2(PC13-ANTI_TAMP)
MAP-SENSOR: R53.2 R56.1 ; port MAP-SENSOR
OIL-SENSOR: R73.1 R74.2 ; port OIL-SENSOR
PA_13: J8.4(SWDIO) U11.46(PA13)
PA_14: J8.2(SWDCK) U11.49(PA14)
USB_CC: J7.A5(CC1) J7.B5(CC2) R68.2
USB_D_N: J7.A7(D-) J7.B7(D-) R55.2
USB_D_P: J7.A6(D+) J7.B6(D+) R52.2
USB_N: R55.1 U11.44(PA11)
USB_P: R52.1 U11.45(PA12)
VBAT_ADC: C47.2 R71.1 R72.2 U11.21(PA5)
NetC39_2: C39.2 U11.5(PH0-OSC_IN) X1.1
NetC40_2: C40.2 U11.6(PH1-OSC_OUT) X1.3
NetC42_2: C42.2 U11.30(VCAP1)
NetC43_2: C43.2 R45.1 SW2.1(P1) SW2.4(P2) U11.7(NRST)
NetD18_1: D18.1(ANODE) R62.1
NetD19_2: D19.2 R63.1 R71.2
NetD20_1: D20.1 J7.A4B9(VBUS) J7.B4A9(VBUS)
NetQ15_1: U11.36(PB15) ; port MAIN_RELAY
NetQ15_2: U11.35(PB14) ; port FUEL_PUMP_RELAY
NetQ15_3: U11.34(PB13) ; port GAS_SOLENOID_RELAY
NetQ15_4: U11.33(PB12) ; port AUX_RELAY
NetQ15_5: U11.28(PB2) ; port LOW_SIDE_1
NetQ15_6: U11.27(PB1) ; port LOW_SIDE_2
NetQ15_7: U11.26(PB0) ; port LOW_SIDE_3
NetR5_2: U11.56(PB4) ; port IGNITION_2
NetR6_2: U11.57(PB5) ; port IGNITION_1
NetR7_2: U11.52(PC11) ; port INJECTOR_2
NetR8_2: U11.53(PC12) ; port INJECTOR_1
NetR13_2: U11.54(PD2) ; port IGNITION_4
NetR14_2: U11.55(PB3) ; port IGNITION_3
NetR15_2: U11.50(PA15) ; port INJECTOR_4
NetR16_2: U11.51(PC10) ; port INJECTOR_3
NetR34_1: R34.1 U10.3(IN1+)
NetR35_2: R35.2 U10.1(OUT1) U10.2(IN1-)
NetR38_1: R38.1 U10.5(IN2+)
NetR39_2: R39.2 U10.6(IN2-) U10.7(OUT2)
NetR42_1: R42.1 U10.12(IN4+)
NetR43_2: R43.2 U10.13(IN4-) U10.14(OUT4)
NetR47_1: R47.1 U10.10(IN3+)
NetR48_2: R48.2 U10.8(OUT3) U10.9(IN3-)
NetR50_2: R50.2 SW1.2(P3) SW1.3(P4) U11.60(BOOT0)
NetR53_1: R53.1 U12.3(IN1+)
NetR54_2: R54.2 U12.1(OUT1) U12.2(IN1-)
NetR59_1: R59.1 U12.5(IN2+)
NetR60_2: R60.2 U12.6(IN2-) U12.7(OUT2)
NetR65_1: R65.1 U12.12(IN4+)
NetR69_2: R69.2 U12.13(IN4-) U12.14(OUT4)
NetR74_1: R74.1 U12.10(IN3+)
NetR75_2: R75.2 U12.8(OUT3) U12.9(IN3-)
NetR77_1: R77.1 U13.3(IN1+)
NetR78_2: R78.2 U13.1(OUT1) U13.2(IN1-)
NetR81_1: R81.1 U13.5(IN2+)
NetR82_2: R82.2 U13.6(IN2-) U13.7(OUT2)
NetR85_1: R85.1 U13.12(IN4+)
NetR85_2: R85.2 R87.1 ; port ANALOG-INPUT-3
NetR86_2: R86.2 U13.13(IN4-) U13.14(OUT4)
NetR89_1: R89.1 U13.10(IN3+)
NetR89_2: R89.2 R91.1 ; port ANALOG-INPUT-4
NetR90_2: R90.2 U13.8(OUT3) U13.9(IN3-)
NetR99_2: U11.61(PB8) ; port TRIGGER_1
NetR115_2: U11.62(PB9) ; port TRIGGER_2
NetR136_2: U11.42(PA9) ; port PWM_2
NetR137_2: U11.43(PA10) ; port PWM_3
NetR141_2: U11.29(PB10) ; port LOW_SIDE_4
NetR142_2: U11.41(PA8) ; port PWM_1
NetU8_3: U11.39(PC8) ; port DC_MOTOR1_1
NetU8_19: U11.40(PC9) ; port DC_MOTOR1_2
NetU9_3: U11.37(PC6) ; port DC_MOTOR2_1
NetU9_19: U11.38(PC7) ; port DC_MOTOR2_2
NetU11_8: U11.8(PC0) ; port EGT_ADC

Not connected (* = marked no-connect by the designer): J7 A8(SBU1)* B8(SBU2)*; PUSB1 1(VBUS)* 2(D-)* 3(D+)* 4(GND)* SH1* SH2* SH3* SH4*; U11 3(PC14-OSC32_IN)* 4(PC15-OSC32_OUT)* 25(PC5)*

### Layout directives
differential pair: USB_D_N, USB_D_P, USB_N, USB_P

### Notes on the sheet
- Microcontroller power and bypassing
- (near R63) Resistor divider ratio
  Vin / Vout = 10.4
- INDICATOR
- I2C pull-up
- (near J8) SW DEBUG
- USB CONNECTIVITY
- Has internal clamp diodes
- (in symbol CONN_SWD) SWD
- (in symbol TLV9064, part A) +; -
- (in symbol TLV9064, part B) +; -
- (in symbol TLV9064, part C) +; -
- (in symbol TLV9064, part D) +; -

### Library data of the parts
C29-C55 = CAP_SMD_MLCC: as C7 on sheet power; PRICE: 100= 1$; ASSEMBLY: ASSEMBLY
  C29 C31-C35 C37 C38 C41 C43-C46 C48-C55: VALUE: 100nF
  C30 C36: VALUE: 10uF
  C39 C40: VALUE: 33pF
  C42: VALUE: 2.2uF
  C47: VALUE: 10nF
D18 = LED_SMD_1206_GRN: as D16 on sheet power; MANF: -; ASSEMBLY: ASSEMBLY; PRICE: 36t@Javan; MANF_P#: -; VALUE: LED1206GRN
D19 = DIODE_SMD_1N4148_SOD80: DIODE, FAST SWTICHING, 0.3A, 0.5W; DESC: DESCRIPTION; PARAM: 75V; PARAM2: 300mA, 0.5W; MANF: MANF; ASSEMBLY: ASSEMBLY; PRICE: PRICE; MANF_P#: 1N4148; VALUE: 1N4148
D20 = DIODE_SMD_SCHOTTKY_SS34: DIODE, SCHOTTKY, 20V, 3A; MANF: VISHAY; DESC: DESCRIPTION; MANF_P#: SS34; ASSEMBLY: ASSEMBLY; PRICE: PRICE; PARAM2: 3A; PARAM: 20V; VALUE: SS34
J7 = CONN_USBC_SMD_16_DX07S016JA1: CONN, USB, Type C, USB 2.0, Right-Angle, SMD; MANF: JAE; MANF_P#: DX07S016JA1R1500; PARAM: 5A; Price: 1.5$; Value: DX07S016JA1
J8 = CONN_SWD: CONN, SWD, ST; VALUE: CONN_SWD
PUSB1 = CONN_USB_B_ST: CONN, USB, B, STRAIGHT, THD; MANF_P#: -; MANF: -; VALUE: CONN_USB_B
R34-R51 R53 R54 R56-R67 R69-R92 = RES_SMD: RESISTOR, SMD; PARAM: -W; DESC: DESCRIPTION; DIST#: MOUSER; PARAM2: 1%; MANF_P#: -; MANF: -; ASSEMBLY: ASSEMBLY; PRICE: 100= 0.5$
  R34 R35 R38 R39 R42 R43 R45 R47 R48 R50 R53 R54 R58-R60 R62-R65 R69 R71 R73-R75 R77 R78 R81 R82 R85 R86 R89 R90: VALUE: 4.7K
  R36 R40 R44 R49 R56 R79 R83 R87 R91: VALUE: 1M
  R37 R41 R46 R51 R57 R61 R70 R76 R80 R84 R88 R92: VALUE: 9.1K
  R66 R67: VALUE: 4.7k
  R72: VALUE: 1K
R52 R55 R68 = RES_SMD_0805: as R32 on sheet etb_driver; MANF_P#: -; MANF: -; ASSEMBLY: ASSEMBLY; PRICE: 100= 0.5$
  R52 R55: VALUE: 22R
  R68: VALUE: 5.1K
SW1 SW2 = SWPBS_SPDT_5X5PTS: SWITCH, PUSH BUTTON, TACTILE, SMD, SPDT, 5X5MM; MANF: CHINA; PARAM: 50mA; DESC: DESCRIPTION; MANF_P#: PTS526SM15SMTR2LFS; PARAM2: 500kCycle; VALUE: PUSHBUTTON; ASSEMBLY: ASSEMBLY; PRICE: -
U10 U12 U13 = TLV9064: IC CMOS 4 CIRCUIT 14TSSOP; Output Current per Channel: 50mA; Gain Bandwidth Product: 10MHz; Operating Supply Current: 538uA; Input Bias Current: 0.5pA; Input Offset Voltage (Vos): 300uV; Number of Channels: 4; Slew Rate: 6.5V/µs; Mount: Surface Mount; Min Operating Temperature: -40°C; Case/Package: TSSOP; RoHS Compliant: Yes; Packaging: Tape and Reel; Number of Pins: 14; Number of Circuits: 4; Max Operating Temperature: 125°C
U11 = STM32F401RCT6: ARM Cortex-M4 32-bit MCU+FPU, 105 DMIPS, 256 kB Flash, 64 kB Internal RAM, 48 I/Os, 64-pin LQFP, -40 to 85 degC, Tray; Manufacturer: STMicroelectronics; Internal RAM Size (kB): 64; Supply Voltage(Vcc) max (V): 3.6; FLASH Size (Prog) (kB): 256; I/Os (High Current): 48; Operating Frequency(F) (Processor speed) (MHz): 84; Supply Voltage(Vcc) min (V): 1.8; DatasheetVersion: Rev. 1; ComponentLink1URL: http://www.st.com/web/en/home.html; ComponentLink1Description: Manufacturer URL; PackageDescription: 64-Pin Low Profile Quad Flat Package, 10 x 10 mm Body, 0.5 mm Pitch; Packing: Tray; ComponentLink3URL: http://www.st.com/st-web-ui/static/active/en/resource/technical/document/datasheet/DM00037051.pdf; PackageVersion: Rev. 4, 06/2013; ComponentLink2URL: http://www.st.com/st-web-ui/static/active/en/resource/technical/document/data_brief/DM00071938.pdf; PartNumber: STM32F401RCT6; PackageReference: LQFP64; Mounting Technology: Surface Mount; ComponentLink2Description: Datasheet; ComponentLink3Description: Package Specification; Core: ARM Cortex-M4
X1 = XTL_4_25MHZ_3225A_2: CRYSTAL 25.00 MHZ 4pF, 10PPM; MANF: ABRACON; PARAM: 10PPM, 4pF, -40~85oC; DESC: DESCRIPTION; DIST#: MOUSER; MANF_P#: ABM8W-25.0000MHZ-4-D1X-T3; PARAM2: 0.6$; ASSEMBLY: ASSEMBLY; PRICE: PRICE; VALUE: XTL_25MHz

## Sheet trigger_interface.SchDoc
size A4; SheetNumber: 6; SheetTotal: 8
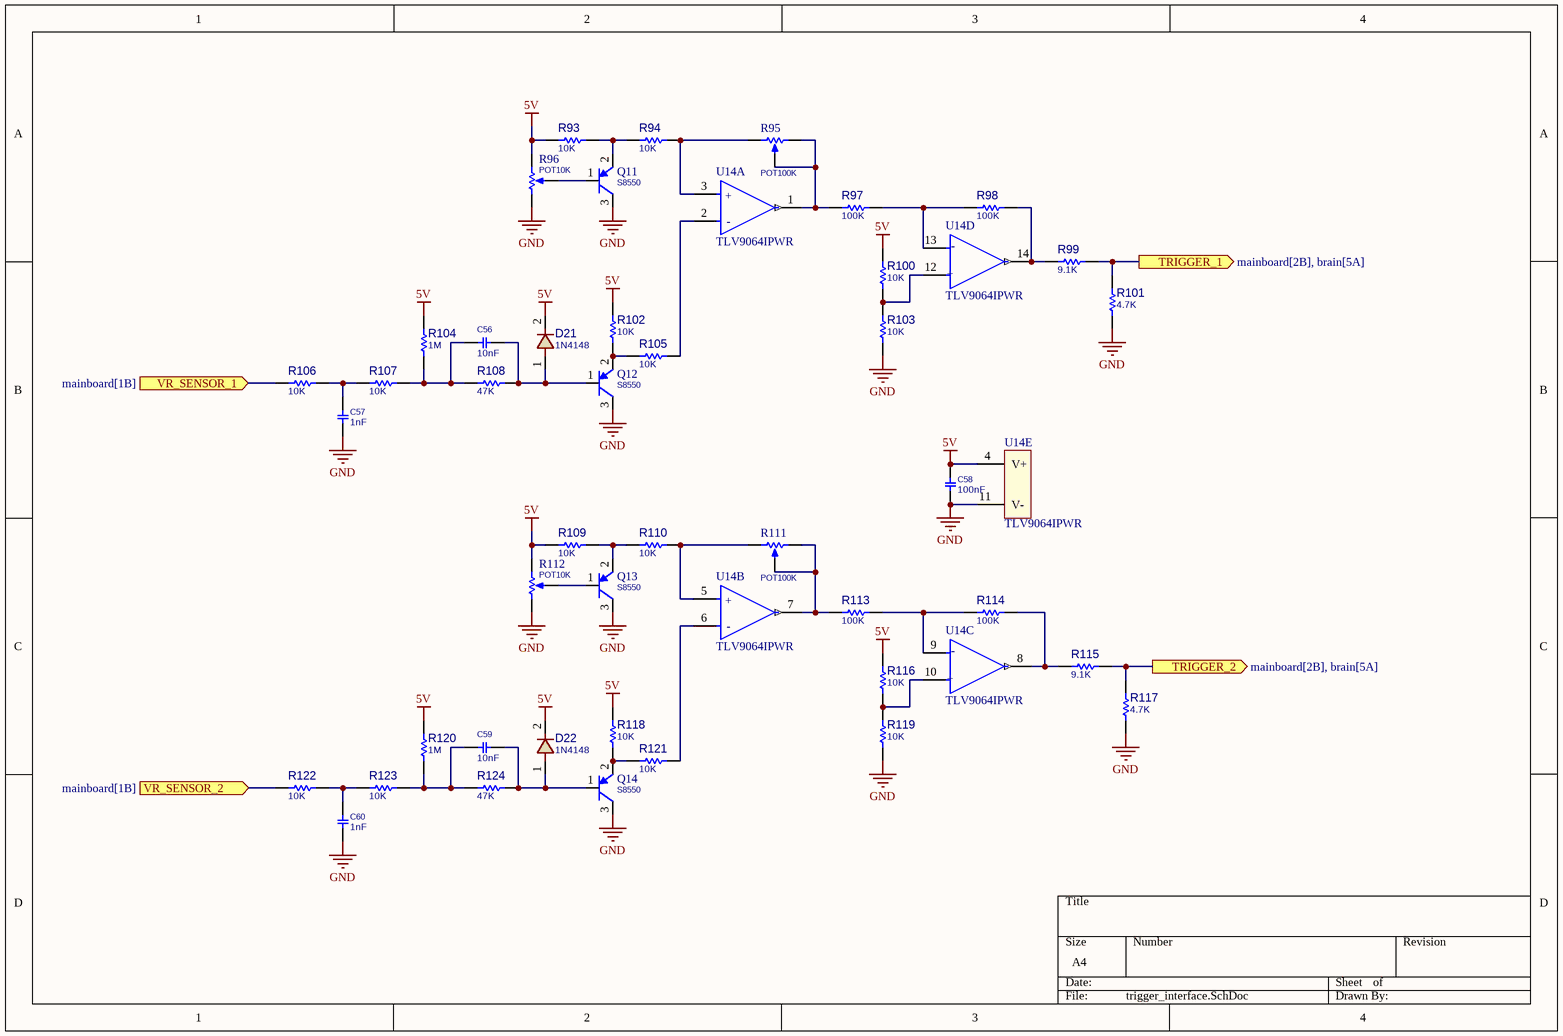
[diagram p5: trigger_interface.SchDoc]

### Parts
C56  10nF  [C0805]
C57  1nF  [C0805]
C58  100nF  [C0805]
C59  10nF  [C0805]
C60  1nF  [C0805]
D21  1N4148  [D_SOD80]
D22  1N4148  [D_SOD80]
Q11  S8550  [SOT23_3]
Q12  S8550  [SOT23_3]
Q13  S8550  [SOT23_3]
Q14  S8550  [SOT23_3]
R93  10K  [R0805]
R94  10K  [R0805]
R95  POT100K  [POT_7X5]
R96  POT10K  [POT_7X5]
R97  100K  [R0805]
R98  100K  [R0805]
R99  9.1K  [R0805]
R100  10K  [R0805]
R101  4.7K  [R0805]
R102  10K  [R0805]
R103  10K  [R0805]
R104  1M  [R0805]
R105  10K  [R0805]
R106  10K  [R0805]
R107  10K  [R0805]
R108  47K  [R0805]
R109  10K  [R0805]
R110  10K  [R0805]
R111  POT100K  [POT_7X5]
R112  POT10K  [POT_7X5]
R113  100K  [R0805]
R114  100K  [R0805]
R115  9.1K  [R0805]
R116  10K  [R0805]
R117  4.7K  [R0805]
R118  10K  [R0805]
R119  10K  [R0805]
R120  1M  [R0805]
R121  10K  [R0805]
R122  10K  [R0805]
R123  10K  [R0805]
R124  47K  [R0805]
U14  TLV9064IPWR  [TTSOP-14]  (parts A,B,C,D,E of 5)

### Ports
TRIGGER_1 (out, see mainboard[2B], brain[5A]), TRIGGER_2 (out, see mainboard[2B], brain[5A]), VR_SENSOR_1 (in, see mainboard[1B]), VR_SENSOR_2 (in, see mainboard[1B])

### Nets
5V: C58.2 D21.2 D22.2 R93.1 R96.3(BOT) R100.2 R102.1 R104.1 R109.1 R112.3(BOT) R116.2 R118.1 R120.1 U14.4(V+)
GND: C57.1 C58.1 C60.1 Q11.3(C) Q12.3(C) Q13.3(C) Q14.3(C) R96.1(TOP) R101.1 R103.2 R112.1(TOP) R117.1 R119.2 U14.11(V-)
VR_SENSOR_1: R106.2 ; port VR_SENSOR_1
VR_SENSOR_2: R122.2 ; port VR_SENSOR_2
NetC56_1: C56.1 D21.1 Q12.1(B) R108.1
NetC56_2: C56.2 R104.2 R107.1 R108.2
NetC57_2: C57.2 R106.1 R107.2
NetC59_1: C59.1 D22.1 Q14.1(B) R124.1
NetC59_2: C59.2 R120.2 R123.1 R124.2
NetC60_2: C60.2 R122.1 R123.2
NetQ11_1: Q11.1(B) R96.2(TAP)
NetQ11_2: Q11.2(E) R93.2 R94.1
NetQ12_2: Q12.2(E) R102.2 R105.1
NetQ13_1: Q13.1(B) R112.2(TAP)
NetQ13_2: Q13.2(E) R109.2 R110.1
NetQ14_2: Q14.2(E) R118.2 R121.1
NetR94_2: R94.2 R95.1(TOP) U14.3(IN1+)
NetR95_2: R95.2(TAP) R95.3(BOT) R97.1 U14.1(OUT1)
NetR97_2: R97.2 R98.1 U14.13(IN4-)
NetR98_2: R98.2 R99.1 U14.14(OUT4)
NetR99_2: R99.2 R101.2 ; port TRIGGER_1
NetR100_1: R100.1 R103.1 U14.12(IN4+)
NetR105_2: R105.2 U14.2(IN1-)
NetR110_2: R110.2 R111.1(TOP) U14.5(IN2+)
NetR111_2: R111.2(TAP) R111.3(BOT) R113.1 U14.7(OUT2)
NetR113_2: R113.2 R114.1 U14.9(IN3-)
NetR114_2: R114.2 R115.1 U14.8(OUT3)
NetR115_2: R115.2 R117.2 ; port TRIGGER_2
NetR116_1: R116.1 R119.1 U14.10(IN3+)
NetR121_2: R121.2 U14.6(IN2-)

### Notes on the sheet
- (in symbol TLV9064, part A) +; -
- (in symbol TLV9064, part B) +; -
- (in symbol TLV9064, part C) -; +
- (in symbol TLV9064, part D) -; +

### Library data of the parts
C56-C60 = CAP_SMD_MLCC: as C7 on sheet power; PRICE: 100= 1$; ASSEMBLY: ASSEMBLY
  C56 C59: VALUE: 10nF
  C57 C60: VALUE: 1nF
  C58: VALUE: 100nF
D21 D22 = DIODE_SMD_1N4148_SOD80: as D19 on sheet brain; MANF: MANF; ASSEMBLY: ASSEMBLY; PRICE: PRICE; MANF_P#: 1N4148; VALUE: 1N4148
Q11-Q14 = PNP_S8550_SOT23: BJT, PNP, 25v, 0.5A, SMD, SOT23; PARAM2: 300mW; PARAM: 25v, 0.5A; MANF_P#: S8550; MANF: -; VALUE: S8550
R93 R94 R97-R110 R113-R124 = RES_SMD: as R34 on sheet brain; MANF_P#: -; MANF: -; ASSEMBLY: ASSEMBLY; PRICE: 100= 0.5$
  R93 R94 R100 R102 R103 R105-R107 R109 R110 R116 R118 R119 R121-R123: VALUE: 10K
  R97 R98 R113 R114: VALUE: 100K
  R99 R115: VALUE: 9.1K
  R101 R117: VALUE: 4.7K
  R104 R120: VALUE: 1M
  R108 R124: VALUE: 47K
R95 R96 R111 R112 = RES_THD_POT_7X5: RESISTOR, THD, Potentiometer
  R95 R111: VALUE: POT100K
  R96 R112: VALUE: POT10K
U14 = TLV9064: as U10 on sheet brain; Mount: Surface Mount; Min Operating Temperature: -40°C; Case/Package: TSSOP; RoHS Compliant: Yes; Packaging: Tape and Reel; Number of Pins: 14; Number of Circuits: 4; Max Operating Temperature: 125°C

## Sheet output_drivers.SchDoc
size A4; SheetNumber: 7; SheetTotal: 8
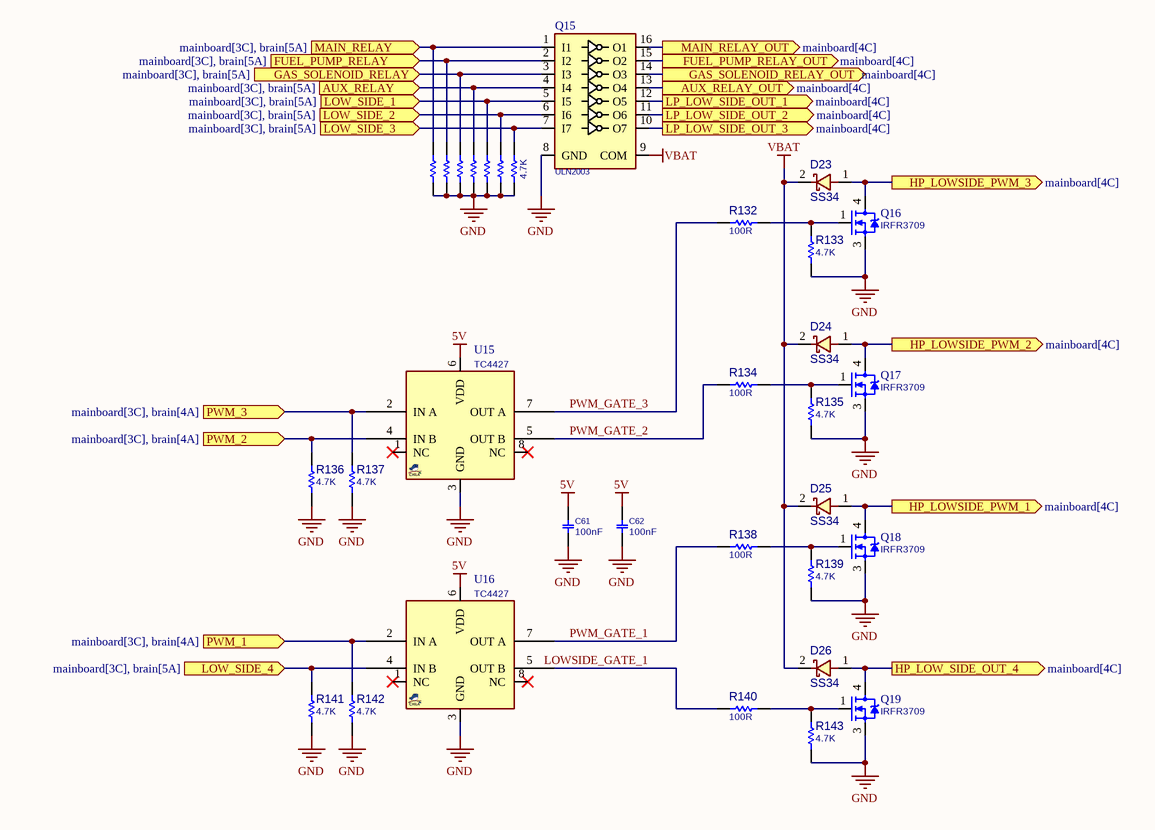
[diagram p6: output_drivers.SchDoc]

### Parts
C61  100nF  [C1206]
C62  100nF  [C1206]
D23  SS34  [D_SMB]
D24  SS34  [D_SMB]
D25  SS34  [D_SMB]
D26  SS34  [D_SMB]
Q15  ULN2003  [SO_16_W]
Q16  IRFR3709  [DPAK_3]
Q17  IRFR3709  [DPAK_3]
Q18  IRFR3709  [DPAK_3]
Q19  IRFR3709  [DPAK_3]
R125  4.7K  [R0805]  (value not drawn)
R126  4.7K  [R0805]  (value not drawn)
R127  4.7K  [R0805]  (value not drawn)
R128  4.7K  [R0805]  (value not drawn)
R129  4.7K  [R0805]  (value not drawn)
R130  4.7K  [R0805]  (value not drawn)
R131  4.7K  [R0805]
R132  100R  [R0805]
R133  4.7K  [R0805]
R134  100R  [R0805]
R135  4.7K  [R0805]
R136  4.7K  [R0805]
R137  4.7K  [R0805]
R138  100R  [R0805]
R139  4.7K  [R0805]
R140  100R  [R0805]
R141  4.7K  [R0805]
R142  4.7K  [R0805]
R143  4.7K  [R0805]
U15  TC4427  [SO_8]
U16  TC4427  [SO_8]

### Ports
AUX_RELAY (in, see mainboard[3C], brain[5A]), AUX_RELAY_OUT (out, see mainboard[4C]), FUEL_PUMP_RELAY (in, see mainboard[3C], brain[5A]), FUEL_PUMP_RELAY_OUT (out, see mainboard[4C]), GAS_SOLENOID_RELAY (in, see mainboard[3C], brain[5A]), GAS_SOLENOID_RELAY_OUT (out, see mainboard[4C]), HP_LOW_SIDE_OUT_4 (out, see mainboard[4C]), HP_LOWSIDE_PWM_1 (out, see mainboard[4C]), HP_LOWSIDE_PWM_2 (out, see mainboard[4C]), HP_LOWSIDE_PWM_3 (out, see mainboard[4C]), LOW_SIDE_1 (in, see mainboard[3C], brain[5A]), LOW_SIDE_2 (in, see mainboard[3C], brain[5A]), LOW_SIDE_3 (in, see mainboard[3C], brain[5A]), LOW_SIDE_4 (in, see mainboard[3C], brain[5A]), LP_LOW_SIDE_OUT_1 (out, see mainboard[4C]), LP_LOW_SIDE_OUT_2 (out, see mainboard[4C]), LP_LOW_SIDE_OUT_3 (out, see mainboard[4C]), MAIN_RELAY (in, see mainboard[3C], brain[5A]), MAIN_RELAY_OUT (out, see mainboard[4C]), PWM_1 (in, see mainboard[3C], brain[4A]), PWM_2 (in, see mainboard[3C], brain[4A]), PWM_3 (in, see mainboard[3C], brain[4A])

### Nets
5V: C61.2 C62.2 U15.6(VDD) U16.6(VDD)
GND: C61.1 C62.1 Q15.8(GND) Q16.3(S) Q17.3(S) Q18.3(S) Q19.3(S) R125.1 R126.1 R127.1 R128.1 R129.1 R130.1 R131.1 R133.1 R135.1 R136.1 R137.1 R139.1 R141.1 R142.1 R143.1 U15.3(GND) U16.3(GND)
VBAT: D23.2 D24.2 D25.2 D26.2 Q15.9(COM)
AUX_RELAY_OUT: Q15.13(O4) ; port AUX_RELAY_OUT
FUEL_PUMP_RELAY_OUT: Q15.15(O2) ; port FUEL_PUMP_RELAY_OUT
GAS_SOLENOID_RELAY_OUT: Q15.14(O3) ; port GAS_SOLENOID_RELAY_OUT
HP_LOW_SIDE_OUT_4: D26.1 Q19.4(D) ; port HP_LOW_SIDE_OUT_4
HP_LOWSIDE_PWM_1: D25.1 Q18.4(D) ; port HP_LOWSIDE_PWM_1
HP_LOWSIDE_PWM_2: D24.1 Q17.4(D) ; port HP_LOWSIDE_PWM_2
HP_LOWSIDE_PWM_3: D23.1 Q16.4(D) ; port HP_LOWSIDE_PWM_3
LOWSIDE_GATE_1: R140.2 U16.5(OUT_B)
LP_LOW_SIDE_OUT_1: Q15.12(O5) ; port LP_LOW_SIDE_OUT_1
LP_LOW_SIDE_OUT_2: Q15.11(O6) ; port LP_LOW_SIDE_OUT_2
MAIN_RELAY_OUT: Q15.16(O1) ; port MAIN_RELAY_OUT
PWM_GATE_1: R138.2 U16.7(OUT_A)
PWM_GATE_2: R134.2 U15.5(OUT_B)
PWM_GATE_3: R132.2 U15.7(OUT_A)
NetQ15_1: Q15.1(I1) R125.2 ; port MAIN_RELAY
NetQ15_2: Q15.2(I2) R126.2 ; port FUEL_PUMP_RELAY
NetQ15_3: Q15.3(I3) R127.2 ; port GAS_SOLENOID_RELAY
NetQ15_4: Q15.4(I4) R128.2 ; port AUX_RELAY
NetQ15_5: Q15.5(I5) R129.2 ; port LOW_SIDE_1
NetQ15_6: Q15.6(I6) R130.2 ; port LOW_SIDE_2
NetQ15_7: Q15.7(I7) R131.2 ; port LOW_SIDE_3
NetQ15_10: Q15.10(O7) ; port LP_LOW_SIDE_OUT_3
NetQ16_1: Q16.1(G) R132.1 R133.2
NetQ17_1: Q17.1(G) R134.1 R135.2
NetQ18_1: Q18.1(G) R138.1 R139.2
NetQ19_1: Q19.1(G) R140.1 R143.2
NetR136_2: R136.2 U15.4(IN_B) ; port PWM_2
NetR137_2: R137.2 U15.2(IN_A) ; port PWM_3
NetR141_2: R141.2 U16.4(IN_B) ; port LOW_SIDE_4
NetR142_2: R142.2 U16.2(IN_A) ; port PWM_1

Not connected (* = marked no-connect by the designer): U15 1(NC)* 8(NC)*; U16 1(NC)* 8(NC)*

### Library data of the parts
C61 C62 = CAP_SMD_MLCC: as C7 on sheet power; PRICE: 100= 1$; ASSEMBLY: ASSEMBLY; VALUE: 100nF
D23-D26 = DIODE_SMD_SCHOTTKY_SS34: as D20 on sheet brain; MANF_P#: SS34; ASSEMBLY: ASSEMBLY; PRICE: PRICE; PARAM2: 3A; PARAM: 20V; VALUE: SS34
Q15 = ULN2003_SOP16: Darlington, 7-CH, 50V, 0.5A; MANF_P#: ULN2003A; MANF: DIODES; PARAM: 7-CH, 50V, 0.5A; PARAM2: -; VALUE: ULN2003
Q16-Q19 = MOSN_IRFR3709_DPAK: MOSFET, N-CH, 30V, 86A, 6.5mRDS, 2300pF; DESC: HEXFET Power MOSFET; MANF_P#: IRFR3709Z; PARAM2: 30VDS, 1.3~2.2VGSth; PARAM: 86A, 6.5mRDS, 2300pF, -55~175oC; ASSEMBLY: ASSEMBLY; PRICE: 1500t@PAYA; VALUE: IRFR3709
R125-R143 = RES_SMD_0805: as R32 on sheet etb_driver; MANF_P#: -; MANF: -; ASSEMBLY: ASSEMBLY; PRICE: 100= 0.5$
  R125-R131 R133 R135-R137 R139 R141-R143: VALUE: 4.7K
  R132 R134 R138 R140: VALUE: 100R
U15 U16 = MOS_DUAL_TC4427: as U1 on sheet coil_inj_drivers; ASSEMBLY: ASSEMBLY; MANF_P#: TC4427; VALUE: TC4427

## Sheet exhaust_gas_temp_oxy.SchDoc
size A4; SheetNumber: 8; SheetTotal: 8
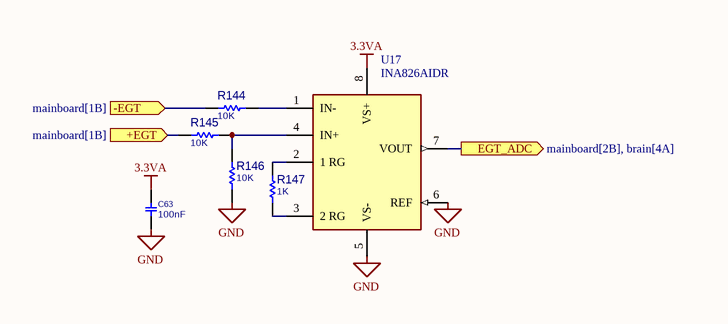
[diagram p7: exhaust_gas_temp_oxy.SchDoc]

### Parts
C63  100nF  [C0805]
R144  10K  [R0805]
R145  10K  [R0805]
R146  10K  [R0805]
R147  1K  [R0805]
U17  INA826AIDR  [SOIC-8]

### Ports
+EGT (in, see mainboard[1B]), -EGT (in, see mainboard[1B]), EGT_ADC (out, see mainboard[2B], brain[4A])

### Nets
3.3VA: C63.2 U17.8(VS+)
GND: C63.1 R146.1 U17.5(VS-) U17.6(REF)
+EGT: R145.1 ; port +EGT
-EGT: R144.2 ; port -EGT
NetR144_1: R144.1 U17.1(IN-)
NetR145_2: R145.2 R146.2 U17.4(IN+)
NetR147_1: R147.1 U17.3(2_RG)
NetR147_2: R147.2 U17.2(1_RG)
NetU11_8: U17.7(VOUT) ; port EGT_ADC

### Library data of the parts
C63 = CAP_SMD_MLCC_0805: CAP, MLCC; PARAM: -, -%; MANF_P#: MANF_PART#; PARAM2: -V; PRICE: 100= 1$; MANF: -; ASSEMBLY: ASSEMBLY; VALUE: 100nF
R144-R147 = RES_SMD_0805: as R32 on sheet etb_driver; MANF_P#: -; MANF: -; ASSEMBLY: ASSEMBLY; PRICE: 100= 0.5$
  R144-R146: VALUE: 10K
  R147: VALUE: 1K
U17 = INA826: IC INST AMP 1 CIRCUIT 8SOIC; Number of Circuits: 1; Common Mode Rejection Ratio: 84dB; Power Supply Rejection Ratio (PSRR): 100dB; Input Voltage Noise Density: 18nV/sqrt Hz; Input Resistance: 100kR; Output Current per Channel: 16mA; Input Offset Voltage (Vos): 150uV; Bandwidth: 1MHz; Supply Current: 200uA; Input Bias Current: 65nA; Max Dual Supply Voltage: 18V; Max Supply Voltage: 36V; Min Supply Voltage: 2.7V; Voltage Gain: 60dB; Slew Rate: 1V/µs; Min Dual Supply Voltage: 1.35V; Number of Elements: 1; Series: -; Number of Pins: 8; Lead Free: Lead Free; Output Current: 16mA; REACH SVHC: No SVHC; Min Operating Temperature: -40°C; Quiescent Current: 200uA; Nominal Supply Current: 200uA; Max Operating Temperature: 125°C; RoHS Compliant: Yes; Case/Package: D; -3db Bandwidth: 1MHz; Radiation Hardening: No; Operating Supply Current: 200uA; Packaging: Tape and Reel; Package Quantity: 1; Number of Amplifiers: 1; Number of Channels: 1